# Altium project BASE.PrjPcb
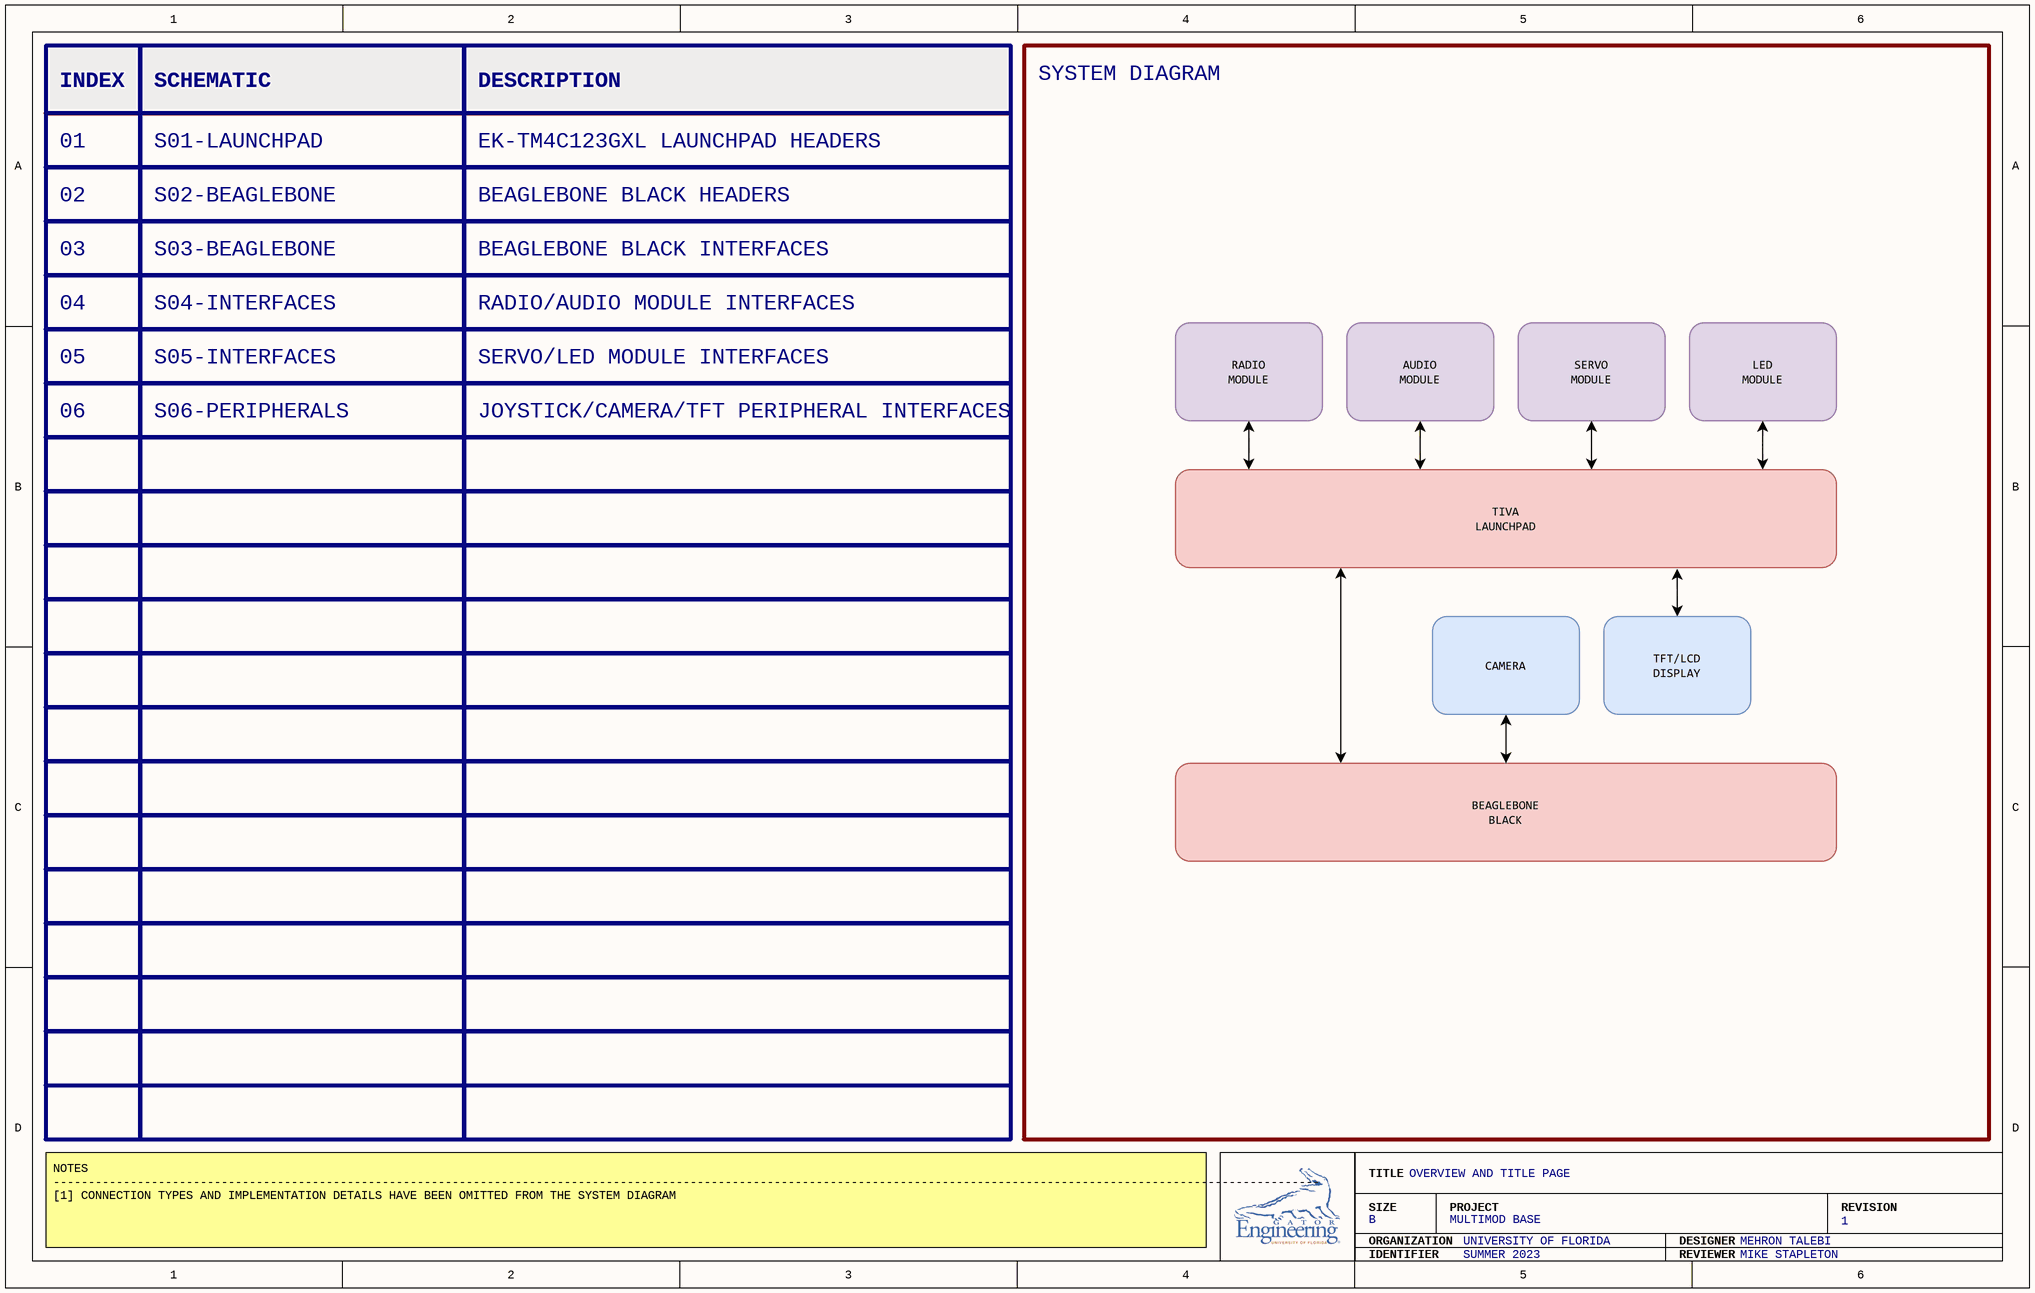
[diagram p0: S00-OVERVIEW.SchDoc]
7 sheets, 35 parts. Net scope: flat (ports and power ports of the same name join across sheets).
Board file: P01-BASE.PcbDoc
Sheets:
  S00-OVERVIEW.SchDoc
  S01-LAUNCHPAD.SchDoc
  S02-BEAGLEBONE.SchDoc
  S03-BEAGLEBONE.SchDoc
  S04-INTERFACES.SchDoc
  S05-INTERFACES.SchDoc
  S06-PERIPHERALS.SchDoc

## Sheet S00-OVERVIEW.SchDoc
size B; SheetNumber: 1; SheetTotal: 7; BLOCK-TITLE: OVERVIEW AND TITLE PAGE; BLOCK-SIZE: B; BLOCK-PROJECT: MULTIMOD BASE; BLOCK-REVISION: 1; BLOCK-ORGANIZATION: UNIVERSITY OF FLORIDA; BLOCK-DESIGNER: MEHRON TALEBI; BLOCK-IDENTIFIER: SUMMER 2023; BLOCK-REVIEWER: MIKE STAPLETON

### Notes on the sheet
- INDEX
- SCHEMATIC
- DESCRIPTION
- SYSTEM DIAGRAM
- 01
- S01-LAUNCHPAD
- EK-TM4C123GXL LAUNCHPAD HEADERS
- 02
- 03
- S02-BEAGLEBONE
- S03-BEAGLEBONE
- BEAGLEBONE BLACK INTERFACES
- BEAGLEBONE BLACK HEADERS
- 04
- S04-INTERFACES
- RADIO/AUDIO MODULE INTERFACES
- 05
- S05-INTERFACES
- SERVO/LED MODULE INTERFACES
- 06
- S06-PERIPHERALS
- JOYSTICK/CAMERA/TFT PERIPHERAL INTERFACES
- NOTES
  -------------------------------------------------------------------------------------------------------------------------------------------------------------------------------------
  [1] CONNECTION TYPES AND IMPLEMENTATION DETAILS HAVE BEEN OMITTED FROM THE SYSTEM DIAGRAM
- TITLE
- SIZE
- ORGANIZATION
- PROJECT
- DESIGNER
- REVISION
- IDENTIFIER
- REVIEWER

## Sheet S01-LAUNCHPAD.SchDoc
size B; SheetNumber: 2; SheetTotal: 7; BLOCK-TITLE: EK-TM4C123GXL LAUNCHPAD HEADERS; BLOCK-SIZE: B; BLOCK-PROJECT: MULTIMOD BASE; BLOCK-REVISION: 1; BLOCK-ORGANIZATION: UNIVERSITY OF FLORIDA; BLOCK-DESIGNER: MEHRON TALEBI; BLOCK-IDENTIFIER: SUMMER 2023; BLOCK-REVIEWER: MIKE STAPLETON
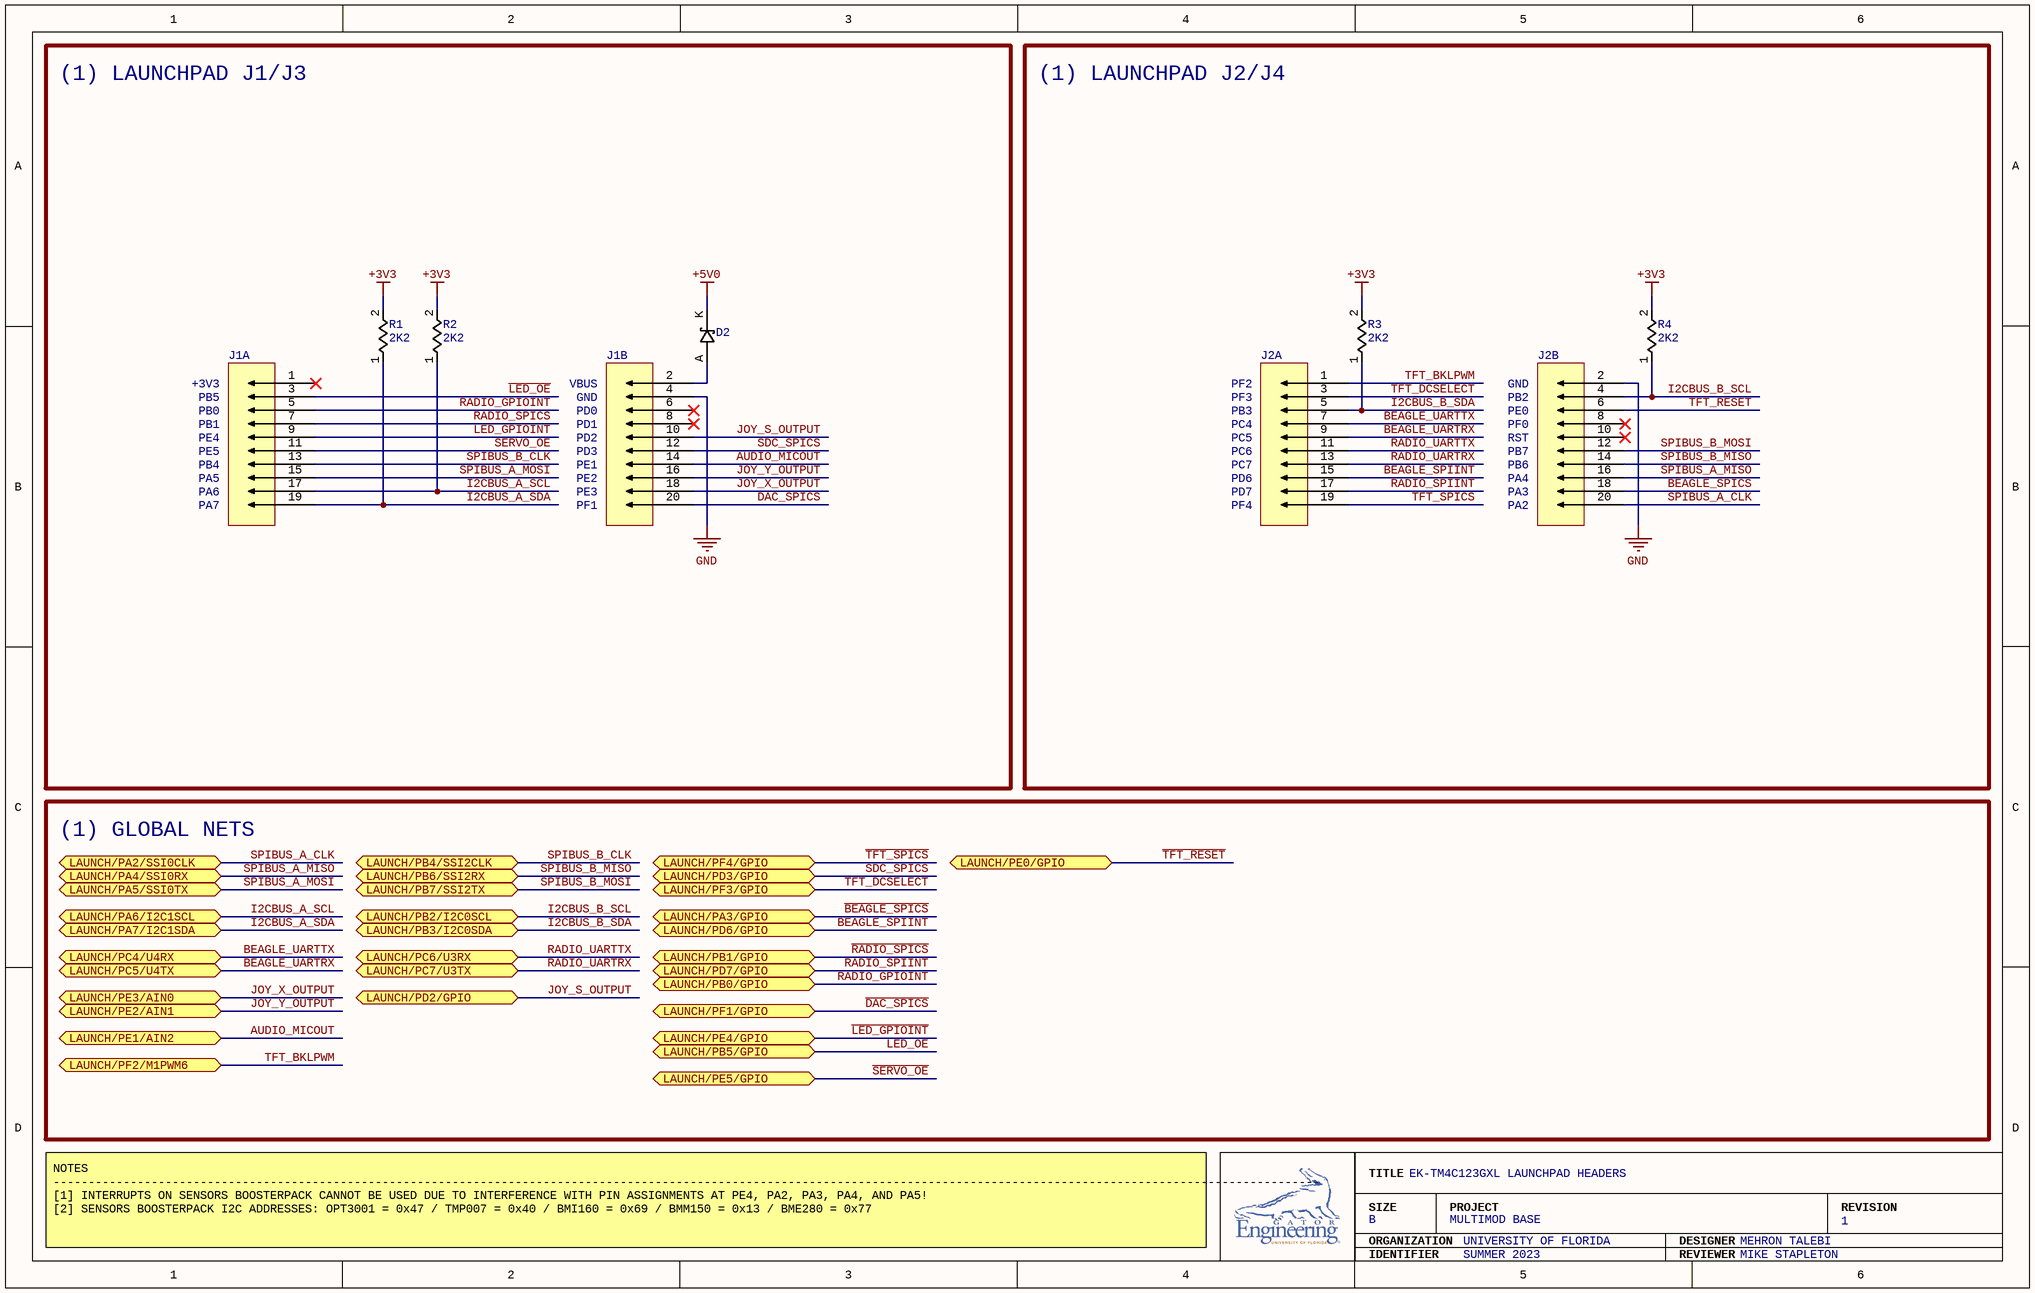
[diagram p1: S01-LAUNCHPAD.SchDoc]

### Parts
D2  RBR5L30BDDTE25  [RBR5L30BDDTE25]  (value not drawn)
J1  95278-101-20LF  [95278-101-20LF]  (value not drawn)  (parts A,B of 2)
J2  95278-101-20LF  [95278-101-20LF]  (value not drawn)  (parts A,B of 2)
R1  2K2  [RC0805FR-072K2L]
R2  2K2  [RC0805FR-072K2L]
R3  2K2  [RC0805FR-072K2L]
R4  2K2  [RC0805FR-072K2L]

### Blocks framed on the sheet
(1) LAUNCHPAD J1/J3: D2 J1 R1 R2
(1) LAUNCHPAD J2/J4: J2 R3 R4

### Ports
LAUNCH/PA2/SSI0CLK (bidir), LAUNCH/PA3/GPIO (bidir), LAUNCH/PA4/SSI0RX (bidir), LAUNCH/PA5/SSI0TX (bidir), LAUNCH/PA6/I2C1SCL (bidir), LAUNCH/PA7/I2C1SDA (bidir), LAUNCH/PB0/GPIO (bidir), LAUNCH/PB1/GPIO (bidir), LAUNCH/PB2/I2C0SCL (bidir), LAUNCH/PB3/I2C0SDA (bidir), LAUNCH/PB4/SSI2CLK (bidir), LAUNCH/PB5/GPIO (bidir), LAUNCH/PB6/SSI2RX (bidir), LAUNCH/PB7/SSI2TX (bidir), LAUNCH/PC4/U4RX (bidir), LAUNCH/PC5/U4TX (bidir), LAUNCH/PC6/U3RX (bidir), LAUNCH/PC7/U3TX (bidir), LAUNCH/PD2/GPIO (bidir), LAUNCH/PD3/GPIO (bidir), LAUNCH/PD6/GPIO (bidir), LAUNCH/PD7/GPIO (bidir), LAUNCH/PE0/GPIO (bidir), LAUNCH/PE1/AIN2 (bidir), LAUNCH/PE2/AIN1 (bidir), LAUNCH/PE3/AIN0 (bidir), LAUNCH/PE4/GPIO (bidir), LAUNCH/PE5/GPIO (bidir), LAUNCH/PF1/GPIO (bidir), LAUNCH/PF2/M1PWM6 (bidir), LAUNCH/PF3/GPIO (bidir), LAUNCH/PF4/GPIO (bidir)

### Nets
+3V3: R1.2 R2.2 R3.2 R4.2
+5V0: D2.K(+)
GND: J1.4 J2.2
~{BEAGLE_SPICS}: J2.18 ; port LAUNCH/PA3/GPIO
~{DAC_SPICS}: J1.20 ; port LAUNCH/PF1/GPIO
~{LED_GPIOINT}: J1.9 ; port LAUNCH/PE4/GPIO
~{LED_OE}: J1.3 ; port LAUNCH/PB5/GPIO
~{RADIO_SPICS}: J1.7 ; port LAUNCH/PB1/GPIO
~{SDC_SPICS}: J1.12 ; port LAUNCH/PD3/GPIO
~{SERVO_OE}: J1.11 ; port LAUNCH/PE5/GPIO
~{TFT_RESET}: J2.6 ; port LAUNCH/PE0/GPIO
~{TFT_SPICS}: J2.19 ; port LAUNCH/PF4/GPIO
AUDIO_MICOUT: J1.14 ; port LAUNCH/PE1/AIN2
BEAGLE_SPIINT: J2.15 ; port LAUNCH/PD6/GPIO
BEAGLE_UARTRX: J2.9 ; port LAUNCH/PC5/U4TX
BEAGLE_UARTTX: J2.7 ; port LAUNCH/PC4/U4RX
I2CBUS_A_SCL: J1.17 R2.1 ; port LAUNCH/PA6/I2C1SCL
I2CBUS_A_SDA: J1.19 R1.1 ; port LAUNCH/PA7/I2C1SDA
I2CBUS_B_SCL: J2.4 R4.1 ; port LAUNCH/PB2/I2C0SCL
I2CBUS_B_SDA: J2.5 R3.1 ; port LAUNCH/PB3/I2C0SDA
JOY_S_OUTPUT: J1.10 ; port LAUNCH/PD2/GPIO
JOY_X_OUTPUT: J1.18 ; port LAUNCH/PE3/AIN0
JOY_Y_OUTPUT: J1.16 ; port LAUNCH/PE2/AIN1
RADIO_GPIOINT: J1.5 ; port LAUNCH/PB0/GPIO
RADIO_SPIINT: J2.17 ; port LAUNCH/PD7/GPIO
RADIO_UARTRX: J2.13 ; port LAUNCH/PC7/U3TX
RADIO_UARTTX: J2.11 ; port LAUNCH/PC6/U3RX
SPIBUS_A_CLK: J2.20 ; port LAUNCH/PA2/SSI0CLK
SPIBUS_A_MISO: J2.16 ; port LAUNCH/PA4/SSI0RX
SPIBUS_A_MOSI: J1.15 ; port LAUNCH/PA5/SSI0TX
SPIBUS_B_CLK: J1.13 ; port LAUNCH/PB4/SSI2CLK
SPIBUS_B_MISO: J2.14 ; port LAUNCH/PB6/SSI2RX
SPIBUS_B_MOSI: J2.12 ; port LAUNCH/PB7/SSI2TX
TFT_BKLPWM: J2.1 ; port LAUNCH/PF2/M1PWM6
TFT_DCSELECT: J2.3 ; port LAUNCH/PF3/GPIO
NetD2_A: D2.A(-) J1.2

Not connected (* = marked no-connect by the designer): J1 1* 6* 8*; J2 8* 10*

### Notes on the sheet
- +3V3
- PB0
- PB1
- PE4
- PB5
- VBUS
- GND
- PD0
- PD1
- PD2
- PF2
- PF3
- PB3
- PC4
- PC5
- PB2
- PE0
- PF0
- RST
- PE5
- PB4
- PA5
- PA6
- PA7
- PD3
- PE1
- PE2
- PE3
- PF1
- PC6
- PC7
- PD6
- PD7
- PF4
- PB7
- PB6
- PA4
- PA3
- PA2
- (1) GLOBAL NETS
- NOTES
  -------------------------------------------------------------------------------------------------------------------------------------------------------------------------------------
  [1] INTERRUPTS ON SENSORS BOOSTERPACK CANNOT BE USED DUE TO INTERFERENCE WITH PIN ASSIGNMENTS AT PE4, PA2, PA3, PA4, AND PA5!
  [2] SENSORS BOOSTERPACK I2C ADDRESSES: OPT3001 = 0x47 / TMP007 = 0x40 / BMI160 = 0x69 / BMM150 = 0x13 / BME280 = 0x77
- TITLE
- SIZE
- ORGANIZATION
- PROJECT
- DESIGNER
- REVISION
- IDENTIFIER
- REVIEWER

### Library data of the parts
D2 = RBR5L30BDDTE25: DIODE SCHOTTKY 30V 5A PMDS; Voltage - Forward (Vf) (Max) @ If: 490 mV @ 5 A; Speed: Fast Recovery =< 500ns, > 200mA (Io); Current - Reverse Leakage @ Vr: 150 µA @ 30 V; Diode Type: Schottky; Voltage - DC Reverse (Vr) (Max): 30 V; Current - Average Rectified (Io): 5A; Mounting Type: Surface Mount; Package / Case: DO-214AC, SMA; Operating Temperature - Junction: -55°C ~ 150°C; Supplier 1: Digi-Key; Supplier Part Number 1: 846-RBR5L30BDDTE25CT-ND
J1 J2 = 95278-101-20LF: CONN HEADER SMD 20POS 2.54MM; Connector Type: Header, Breakaway; Pitch - Mating: 0.100" (2.54mm); Number of Positions: 20; Number of Positions Loaded: All; Style: Board to Board; Shrouding: Unshrouded; Contact Length - Mating: 0.232" (5.90mm); Material Flammability Rating: UL94 V-0; Current Rating (Amps): 3A per Contact; Contact Type: Male Pin; Number of Rows: 2; Row Spacing - Mating: 0.100" (2.54mm); Mounting Type: Surface Mount; Termination: Solder; Fastening Type: Push-Pull; Insulation Height: 0.100" (2.54mm); Contact Shape: Square; Contact Finish - Mating: Gold, GXT™; Contact Finish Thickness - Mating: 30.0µin (0.76µm); Contact Finish - Post: Tin; Contact Material: Phosphor Bronze; Insulation Material: Thermoplastic; Operating Temperature: -65°C ~ 125°C; Insulation Color: Black; Contact Finish Thickness - Post: 78.7µin (2.00µm); Supplier 1: Arrow Electronics; Supplier Part Number 1: 95278-101-20LF
R1-R4 = RC0805FR-072K2L: RES 2.2K OHM 1% 1/8W 0805; Resistance: 2.2 kOhms; Power (Watts): 0.125W, 1/8W; Temperature Coefficient: ±100ppm/°C; Tolerance: ±1%; Composition: Thick Film; Features: Moisture Resistant; Operating Temperature: -55°C ~ 155°C; Package / Case: 0805 (2012 Metric); Supplier Device Package: 0805; Size / Dimension: 0.079" L x 0.049" W (2.00mm x 1.25mm); Height - Seated (Max): 0.024" (0.60mm); Number of Terminations: 2; Supplier 1: Digi-Key; Supplier Part Number 1: 311-2.20KCRDKR-ND

## Sheet S02-BEAGLEBONE.SchDoc
size B; SheetNumber: 3; SheetTotal: 7; BLOCK-TITLE: BEAGLEBONE BLACK HEADERS; BLOCK-SIZE: B; BLOCK-PROJECT: MULTIMOD BASE; BLOCK-REVISION: 1; BLOCK-ORGANIZATION: UNIVERSITY OF FLORIDA; BLOCK-DESIGNER: MEHRON TALEBI; BLOCK-IDENTIFIER: SUMMER 2023; BLOCK-REVIEWER: MIKE STAPLETON
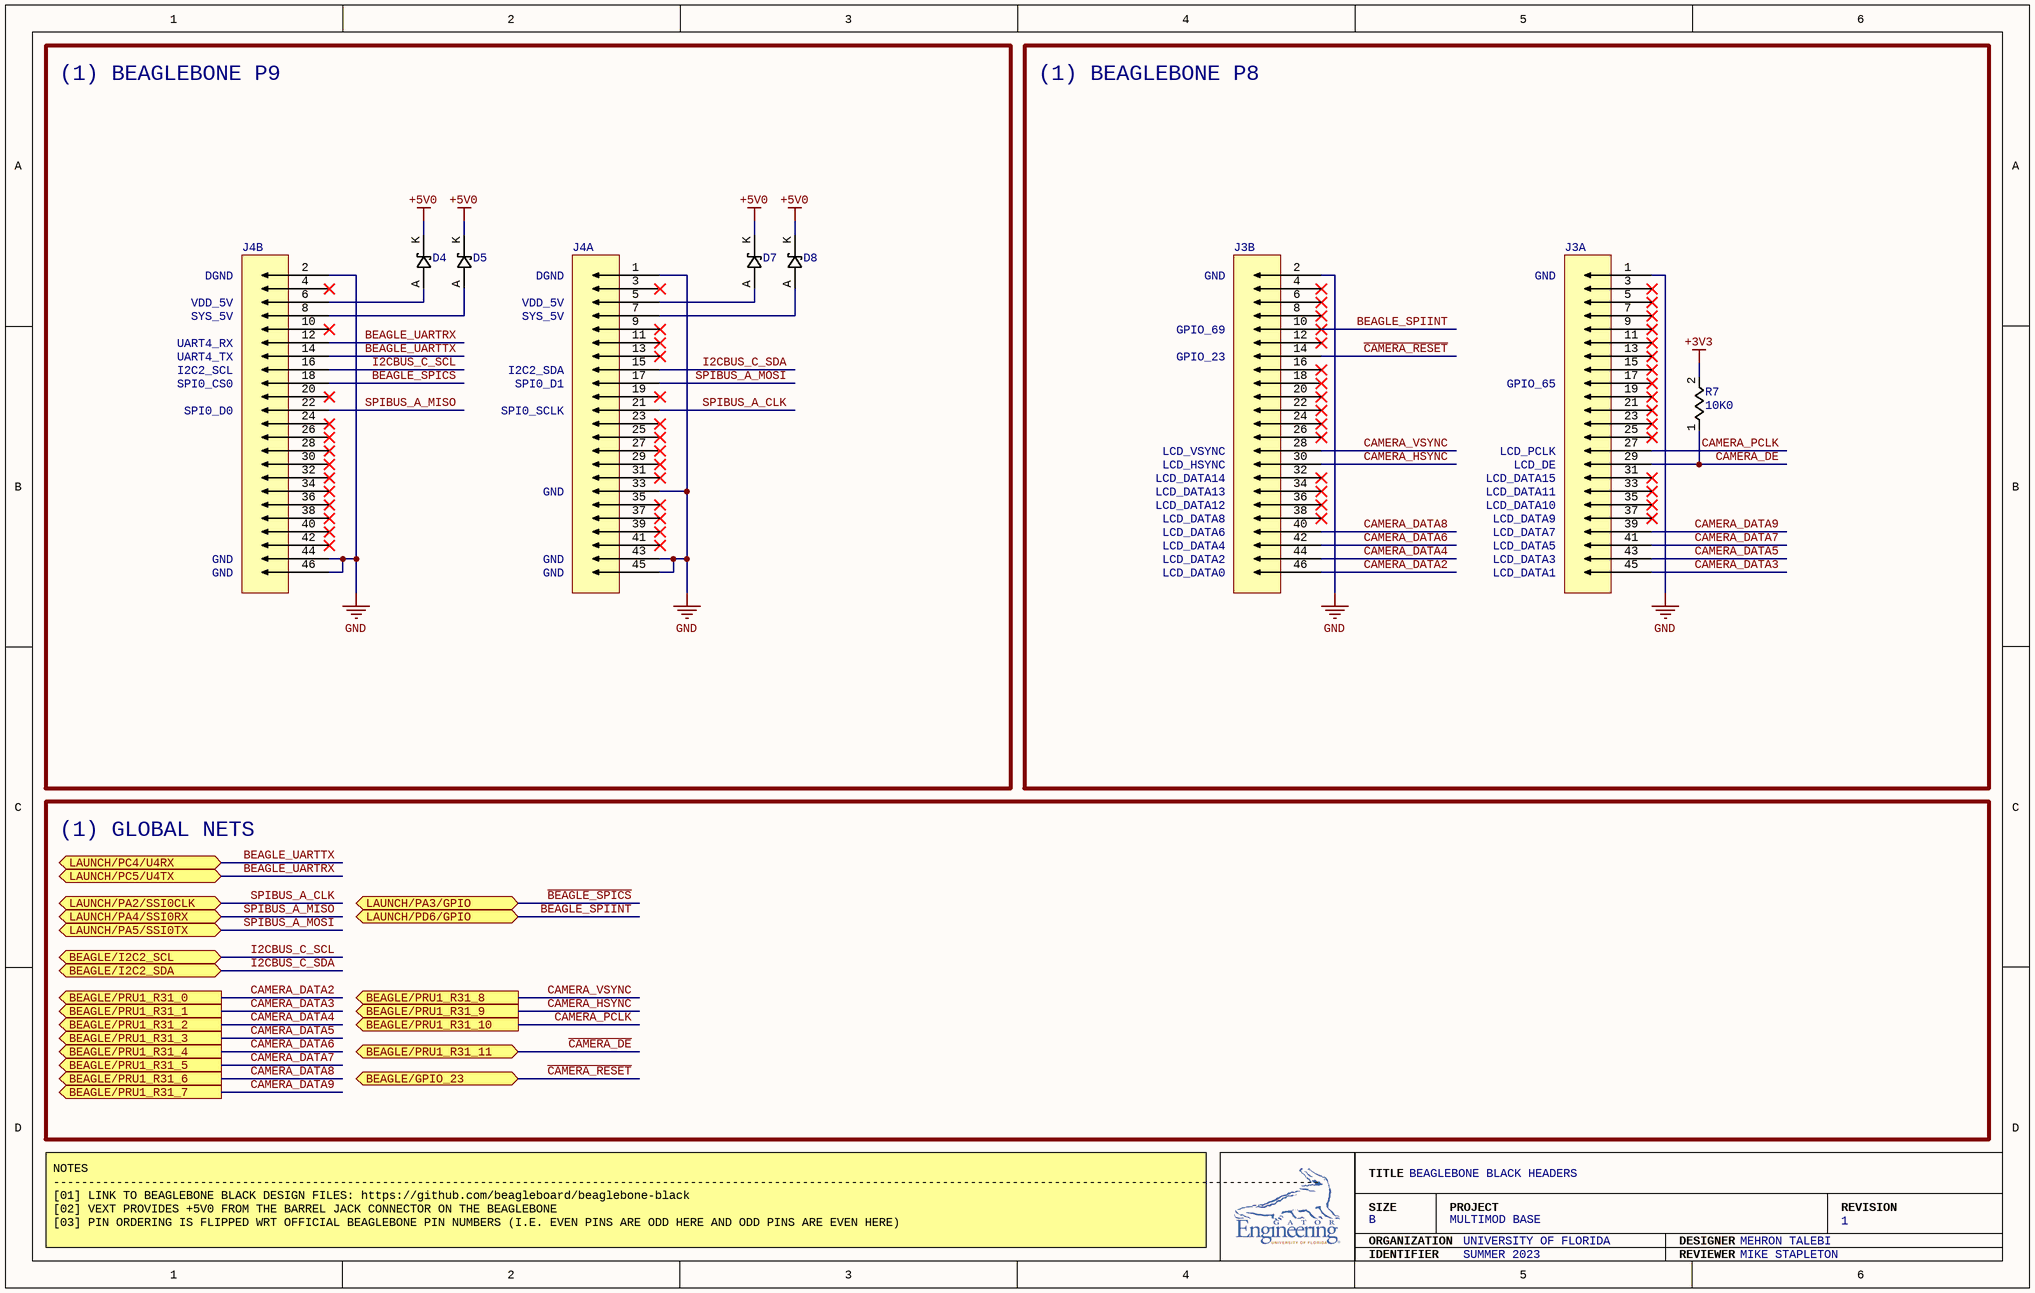
[diagram p2: S02-BEAGLEBONE.SchDoc]

### Parts
D4  RBR5L30BDDTE25  [RBR5L30BDDTE25]  (value not drawn)
D5  RBR5L30BDDTE25  [RBR5L30BDDTE25]  (value not drawn)
D7  RBR5L30BDDTE25  [RBR5L30BDDTE25]  (value not drawn)
D8  RBR5L30BDDTE25  [RBR5L30BDDTE25]  (value not drawn)
J3  95278-101-46LF  [95278-101-46LF]  (value not drawn)  (parts A,B of 2)
J4  95278-101-46LF  [95278-101-46LF]  (value not drawn)  (parts A,B of 2)
R7  10K0  [RC0805FR-0710KL]

### Blocks framed on the sheet
(1) BEAGLEBONE P9: D4 D5 D7 D8 J4
(1) BEAGLEBONE P8: J3 R7

### Ports
BEAGLE/GPIO_23 (bidir), BEAGLE/I2C2_SCL (bidir), BEAGLE/I2C2_SDA (bidir), BEAGLE/PRU1_R31_0 (out), BEAGLE/PRU1_R31_1 (out), BEAGLE/PRU1_R31_2 (out), BEAGLE/PRU1_R31_3 (out), BEAGLE/PRU1_R31_4 (out), BEAGLE/PRU1_R31_5 (out), BEAGLE/PRU1_R31_6 (out), BEAGLE/PRU1_R31_7 (out), BEAGLE/PRU1_R31_8 (out), BEAGLE/PRU1_R31_9 (out), BEAGLE/PRU1_R31_10 (out), BEAGLE/PRU1_R31_11 (bidir), LAUNCH/PA2/SSI0CLK (bidir), LAUNCH/PA3/GPIO (bidir), LAUNCH/PA4/SSI0RX (bidir), LAUNCH/PA5/SSI0TX (bidir), LAUNCH/PC4/U4RX (bidir), LAUNCH/PC5/U4TX (bidir), LAUNCH/PD6/GPIO (bidir)

### Nets
+3V3: R7.2
+5V0: D4.K(+) D5.K(+) D7.K(+) D8.K(+)
GND: J3.1 J3.2 J4.1 J4.2 J4.33 J4.43 J4.44 J4.45 J4.46
~{BEAGLE_SPICS}: J4.18 ; port LAUNCH/PA3/GPIO
~{CAMERA_DE}: J3.29 R7.1 ; port BEAGLE/PRU1_R31_11
~{CAMERA_RESET}: J3.14 ; port BEAGLE/GPIO_23
BEAGLE_SPIINT: J3.10 ; port LAUNCH/PD6/GPIO
BEAGLE_UARTRX: J4.12 ; port LAUNCH/PC5/U4TX
BEAGLE_UARTTX: J4.14 ; port LAUNCH/PC4/U4RX
CAMERA_DATA2: J3.46 ; port BEAGLE/PRU1_R31_0
CAMERA_DATA3: J3.45 ; port BEAGLE/PRU1_R31_1
CAMERA_DATA4: J3.44 ; port BEAGLE/PRU1_R31_2
CAMERA_DATA5: J3.43 ; port BEAGLE/PRU1_R31_3
CAMERA_DATA6: J3.42 ; port BEAGLE/PRU1_R31_4
CAMERA_DATA7: J3.41 ; port BEAGLE/PRU1_R31_5
CAMERA_DATA8: J3.40 ; port BEAGLE/PRU1_R31_6
CAMERA_DATA9: J3.39 ; port BEAGLE/PRU1_R31_7
CAMERA_HSYNC: J3.30 ; port BEAGLE/PRU1_R31_9
CAMERA_PCLK: J3.27 ; port BEAGLE/PRU1_R31_10
CAMERA_VSYNC: J3.28 ; port BEAGLE/PRU1_R31_8
I2CBUS_C_SCL: J4.16 ; port BEAGLE/I2C2_SCL
I2CBUS_C_SDA: J4.15 ; port BEAGLE/I2C2_SDA
SPIBUS_A_CLK: J4.21 ; port LAUNCH/PA2/SSI0CLK
SPIBUS_A_MISO: J4.22 ; port LAUNCH/PA4/SSI0RX
SPIBUS_A_MOSI: J4.17 ; port LAUNCH/PA5/SSI0TX
NetD4_A: D4.A(-) J4.6
NetD5_A: D5.A(-) J4.8
NetD7_A: D7.A(-) J4.5
NetD8_A: D8.A(-) J4.7

Not connected (* = marked no-connect by the designer): J3 3* 4* 5* 6* 7* 8* 9* 11* 12* 13* 15* 16* 17* 18* 19* 20* 21* 22* 23* 24* 25* 26* 31* 32* 33* 34* 35* 36* 37* 38*; J4 3* 4* 9* 10* 11* 13* 19* 20* 23* 24* 25* 26* 27* 28* 29* 30* 31* 32* 34* 35* 36* 37* 38* 39* 40* 41* 42*

### Notes on the sheet
- DGND
- VDD_5V
- GND
- SYS_5V
- I2C2_SCL
- UART4_RX
- UART4_TX
- I2C2_SDA
- GPIO_23
- GPIO_69
- SPI0_CS0
- SPI0_D0
- SPI0_D1
- SPI0_SCLK
- GPIO_65
- LCD_VSYNC
- LCD_HSYNC
- LCD_DATA13
- LCD_DATA12
- LCD_DATA14
- LCD_PCLK
- LCD_DE
- LCD_DATA11
- LCD_DATA10
- LCD_DATA15
- LCD_DATA8
- LCD_DATA6
- LCD_DATA4
- LCD_DATA2
- LCD_DATA0
- LCD_DATA9
- LCD_DATA7
- LCD_DATA5
- LCD_DATA3
- LCD_DATA1
- (1) GLOBAL NETS
- NOTES
  -------------------------------------------------------------------------------------------------------------------------------------------------------------------------------------
  [01] LINK TO BEAGLEBONE BLACK DESIGN FILES: https://github.com/beagleboard/beaglebone-black
  [02] VEXT PROVIDES +5V0 FROM THE BARREL JACK CONNECTOR ON THE BEAGLEBONE
  [03] PIN ORDERING IS FLIPPED WRT OFFICIAL BEAGLEBONE PIN NUMBERS (I.E. EVEN PINS ARE ODD HERE AND ODD PINS ARE EVEN HERE)
- TITLE
- SIZE
- ORGANIZATION
- PROJECT
- DESIGNER
- REVISION
- IDENTIFIER
- REVIEWER

### Library data of the parts
D4 D5 D7 D8 = RBR5L30BDDTE25: as D2 on sheet S01-LAUNCHPAD; Diode Type: Schottky; Voltage - DC Reverse (Vr) (Max): 30 V; Current - Average Rectified (Io): 5A; Mounting Type: Surface Mount; Package / Case: DO-214AC, SMA; Operating Temperature - Junction: -55°C ~ 150°C; Supplier 1: Digi-Key; Supplier Part Number 1: 846-RBR5L30BDDTE25CT-ND
J3 J4 = 95278-101-46LF: CONN HEADER SMD 46POS 2.54MM; Connector Type: Header, Breakaway; Pitch - Mating: 0.100" (2.54mm); Number of Positions: 46; Number of Positions Loaded: All; Style: Board to Board; Shrouding: Unshrouded; Contact Length - Mating: 0.232" (5.90mm); Material Flammability Rating: UL94 V-0; Current Rating (Amps): 3A per Contact; Contact Type: Male Pin; Number of Rows: 2; Row Spacing - Mating: 0.100" (2.54mm); Mounting Type: Surface Mount; Termination: Solder; Fastening Type: Push-Pull; Insulation Height: 0.100" (2.54mm); Contact Shape: Square; Contact Finish - Mating: Gold, GXT™; Contact Finish Thickness - Mating: 30.0µin (0.76µm); Contact Finish - Post: Tin; Contact Material: Phosphor Bronze; Insulation Material: Thermoplastic; Operating Temperature: -65°C ~ 125°C; Insulation Color: Black; Contact Finish Thickness - Post: 78.7µin (2.00µm); Supplier 1: Newark; Supplier Part Number 1: 17M5553
R7 = RC0805FR-0710KL: RES 10K OHM 1% 1/8W 0805; Resistance: 10 kOhms; Power (Watts): 0.125W, 1/8W; Temperature Coefficient: ±100ppm/°C; Tolerance: ±1%; Composition: Thick Film; Features: Moisture Resistant; Operating Temperature: -55°C ~ 155°C; Package / Case: 0805 (2012 Metric); Supplier Device Package: 0805; Size / Dimension: 0.079" L x 0.049" W (2.00mm x 1.25mm); Height - Seated (Max): 0.024" (0.60mm); Number of Terminations: 2; Supplier 1: Future Electronics; Supplier Part Number 1: 3310877

## Sheet S03-BEAGLEBONE.SchDoc
size B; SheetNumber: 4; SheetTotal: 7; BLOCK-TITLE: BEAGLEBONE BLACK INTERFACES; BLOCK-SIZE: B; BLOCK-PROJECT: MULTIMOD BASE; BLOCK-REVISION: 1; BLOCK-ORGANIZATION: UNIVERSITY OF FLORIDA; BLOCK-DESIGNER: MEHRON TALEBI; BLOCK-IDENTIFIER: SUMMER 2023; BLOCK-REVIEWER: MIKE STAPLETON
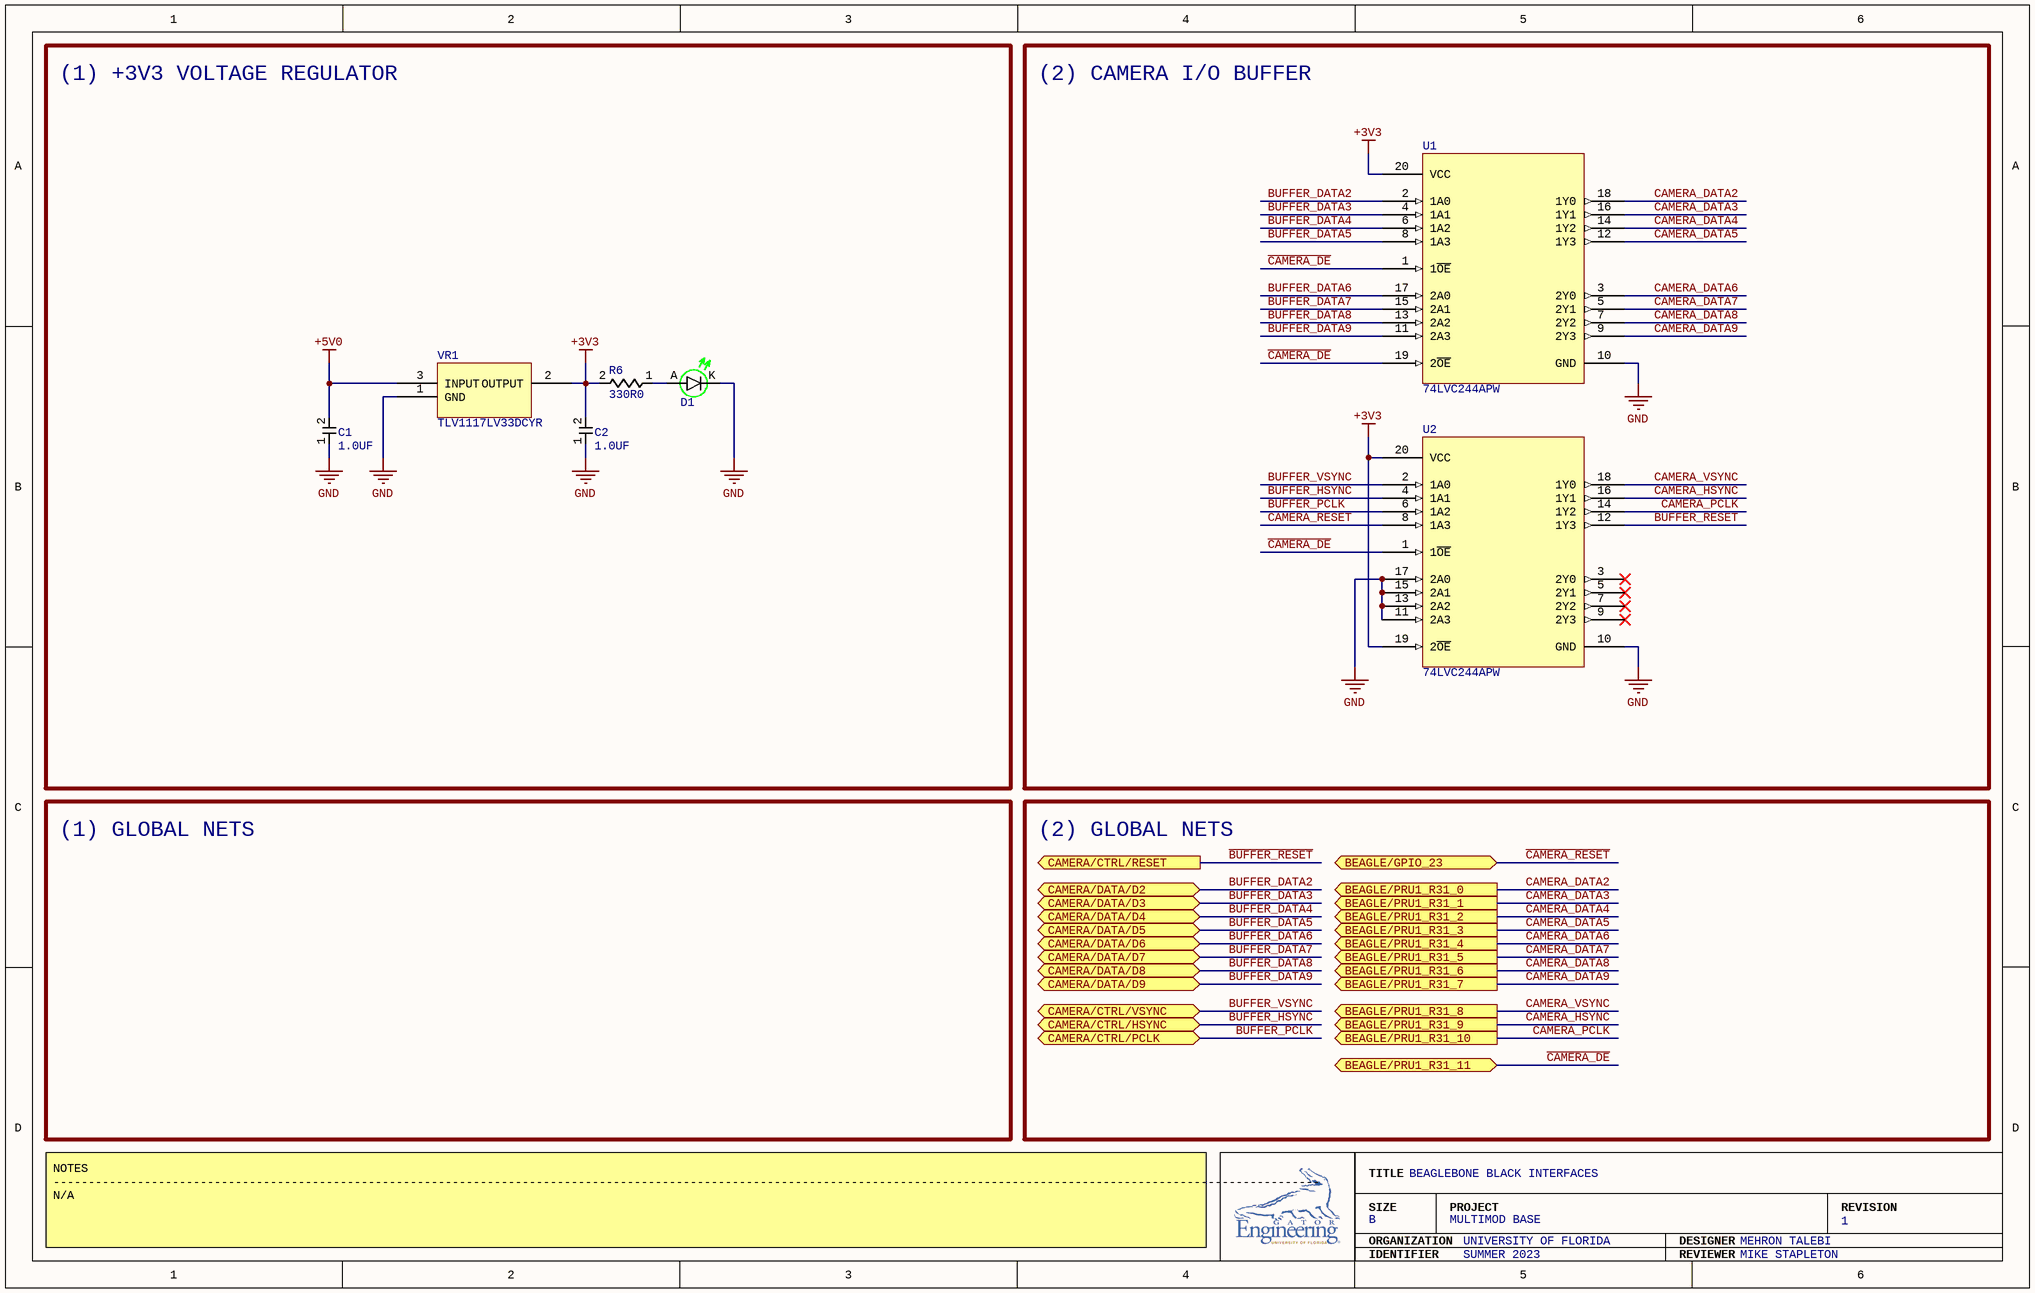
[diagram p3: S03-BEAGLEBONE.SchDoc]

### Parts
C1  1.0UF  [CL21B105KAFNFNE]
C2  1.0UF  [CL21B105KAFNFNE]
D1  LTST-C171GKT  [LTST-C171GKT]  (value not drawn)
R6  330R0  [RC0805FR-7W330RL]
U1  74LVC244APW  [74LVC244APW]
U2  74LVC244APW  [74LVC244APW]
VR1  TLV1117LV33DCYR  [TLV1117LV33DCYR]

### Blocks framed on the sheet
(1) +3V3 VOLTAGE REGULATOR: C1 C2 D1 R6 VR1
(2) CAMERA I/O BUFFER: U1 U2

### Ports
BEAGLE/GPIO_23 (bidir), BEAGLE/PRU1_R31_0 (out), BEAGLE/PRU1_R31_1 (out), BEAGLE/PRU1_R31_2 (out), BEAGLE/PRU1_R31_3 (out), BEAGLE/PRU1_R31_4 (out), BEAGLE/PRU1_R31_5 (out), BEAGLE/PRU1_R31_6 (out), BEAGLE/PRU1_R31_7 (out), BEAGLE/PRU1_R31_8 (out), BEAGLE/PRU1_R31_9 (out), BEAGLE/PRU1_R31_10 (out), BEAGLE/PRU1_R31_11 (bidir), CAMERA/CTRL/HSYNC (bidir), CAMERA/CTRL/PCLK (bidir), CAMERA/CTRL/RESET (out), CAMERA/CTRL/VSYNC (bidir), CAMERA/DATA/D2 (bidir), CAMERA/DATA/D3 (bidir), CAMERA/DATA/D4 (bidir), CAMERA/DATA/D5 (bidir), CAMERA/DATA/D6 (bidir), CAMERA/DATA/D7 (bidir), CAMERA/DATA/D8 (bidir), CAMERA/DATA/D9 (bidir)

### Nets
+3V3: C2.2 R6.2 U1.20(VCC) U2.19(2~{OE}) U2.20(VCC) VR1.2(OUTPUT)
+5V0: C1.2 VR1.3(INPUT)
GND: C1.1 C2.1 D1.K U1.10(GND) U2.10(GND) U2.11(2A3) U2.13(2A2) U2.15(2A1) U2.17(2A0) VR1.1(GND)
~{BUFFER_RESET}: U2.12(1Y3) ; port CAMERA/CTRL/RESET
~{CAMERA_DE}: U1.1(1~{OE}) U1.19(2~{OE}) U2.1(1~{OE}) ; port BEAGLE/PRU1_R31_11
~{CAMERA_RESET}: U2.8(1A3) ; port BEAGLE/GPIO_23
BUFFER_DATA2: U1.2(1A0) ; port CAMERA/DATA/D2
BUFFER_DATA3: U1.4(1A1) ; port CAMERA/DATA/D3
BUFFER_DATA4: U1.6(1A2) ; port CAMERA/DATA/D4
BUFFER_DATA5: U1.8(1A3) ; port CAMERA/DATA/D5
BUFFER_DATA6: U1.17(2A0) ; port CAMERA/DATA/D6
BUFFER_DATA7: U1.15(2A1) ; port CAMERA/DATA/D7
BUFFER_DATA8: U1.13(2A2) ; port CAMERA/DATA/D8
BUFFER_DATA9: U1.11(2A3) ; port CAMERA/DATA/D9
BUFFER_HSYNC: U2.4(1A1) ; port CAMERA/CTRL/HSYNC
BUFFER_PCLK: U2.6(1A2) ; port CAMERA/CTRL/PCLK
BUFFER_VSYNC: U2.2(1A0) ; port CAMERA/CTRL/VSYNC
CAMERA_DATA2: U1.18(1Y0) ; port BEAGLE/PRU1_R31_0
CAMERA_DATA3: U1.16(1Y1) ; port BEAGLE/PRU1_R31_1
CAMERA_DATA4: U1.14(1Y2) ; port BEAGLE/PRU1_R31_2
CAMERA_DATA5: U1.12(1Y3) ; port BEAGLE/PRU1_R31_3
CAMERA_DATA6: U1.3(2Y0) ; port BEAGLE/PRU1_R31_4
CAMERA_DATA7: U1.5(2Y1) ; port BEAGLE/PRU1_R31_5
CAMERA_DATA8: U1.7(2Y2) ; port BEAGLE/PRU1_R31_6
CAMERA_DATA9: U1.9(2Y3) ; port BEAGLE/PRU1_R31_7
CAMERA_HSYNC: U2.16(1Y1) ; port BEAGLE/PRU1_R31_9
CAMERA_PCLK: U2.14(1Y2) ; port BEAGLE/PRU1_R31_10
CAMERA_VSYNC: U2.18(1Y0) ; port BEAGLE/PRU1_R31_8
NetD1_A: D1.A R6.1

Not connected (* = marked no-connect by the designer): U2 3(2Y0)* 5(2Y1)* 7(2Y2)* 9(2Y3)*

### Notes on the sheet
- (1) GLOBAL NETS
- (2) GLOBAL NETS
- NOTES
  -------------------------------------------------------------------------------------------------------------------------------------------------------------------------------------
  N/A
- TITLE
- SIZE
- ORGANIZATION
- PROJECT
- DESIGNER
- REVISION
- IDENTIFIER
- REVIEWER

### Library data of the parts
C1 C2 = CL21B105KAFNFNE: CAP CER 1UF 25V X7R 0805; Capacitance: 1 µF; Tolerance: ±10%; Voltage - Rated: 25V; Temperature Coefficient: X7R; Operating Temperature: -55°C ~ 125°C; Applications: General Purpose; Mounting Type: Surface Mount, MLCC; Package / Case: 0805 (2012 Metric); Size / Dimension: 0.079" L x 0.049" W (2.00mm x 1.25mm); Thickness (Max): 0.053" (1.35mm); Supplier 1: Arrow Electronics; Supplier Part Number 1: CL21B105KAFNFNE
D1 = LTST-C171GKT: LED GREEN CLEAR CHIP SMD; Configuration: Standard; Lens Color: Colorless; Millicandela Rating: 12mcd; Lens Style: Rectangle with Flat Top; Lens Size: 1.40mm x 1.25mm; Voltage - Forward (Vf) (Typ): 2.1V; Current - Test: 20mA; Viewing Angle: 130°; Wavelength - Dominant: 569nm; Wavelength - Peak: 565nm; Color: Green; Lens Transparency: Clear; Mounting Type: Surface Mount; Package / Case: 0805 (2012 Metric); Supplier Device Package: Chip LED; Size / Dimension: 2.00mm L x 1.25mm W; Height (Max): 0.90mm; Supplier 1: Digi-Key; Supplier Part Number 1: 160-1423-1-ND
R6 = RC0805FR-7W330RL: RES 330 OHM 1% 1/4W 0805; Resistance: 330 Ohms; Power (Watts): 0.25W, 1/4W; Temperature Coefficient: ±100ppm/°C; Tolerance: ±1%; Composition: Thick Film; Features: Moisture Resistant; Operating Temperature: -55°C ~ 155°C; Supplier Device Package: 0805; Size / Dimension: 0.079" L x 0.049" W (2.00mm x 1.25mm); Height - Seated (Max): 0.024" (0.60mm); Number of Terminations: 2; Supplier 1: Mouser; Supplier Part Number 1: 603-RC0805FR-7W330RL
U1 U2 = 74LVC244APW: IC BUF NON-INVERT 3.6V 20TSSOP; Logic Type: Buffer, Non-Inverting; Number of Elements: 2; Number of Bits per Element: 4; Output Type: 3-State; Current - Output High, Low: 24mA, 24mA; Voltage - Supply: 1.2V ~ 3.6V; Operating Temperature: -40°C ~ 125°C (TA); Mounting Type: Surface Mount; Package / Case: 20-TSSOP (0.173", 4.40mm Width); Supplier Device Package: 20-TSSOP; Supplier 1: Digi-Key; Supplier Part Number 1: 1727-2875-1-ND
VR1 = TLV1117LV33DCYR: IC REG LINEAR 3.3V 1A SOT223-4; Output Configuration: Positive; Output Type: Fixed; Number of Regulators: 1; Voltage - Input (Max): 5.5V; Voltage Dropout (Max): 1.3V @ 800mA; Current - Quiescent (Iq): 100 µA; PSRR: 75dB (120Hz); Protection Features: Over Current, Over Temperature; Voltage - Output (Min/Fixed): 3.3V; Current - Output: 1A; Operating Temperature: -40°C ~ 125°C; Mounting Type: Surface Mount; Package / Case: TO-261-4, TO-261AA; ComponentLink1Description: Datasheet; ComponentLink1URL: https://www.ti.com/lit/ds/symlink/tlv1117lv.pdf; Supplier 1: Digi-Key; Supplier Part Number 1: 296-28778-1-ND

## Sheet S04-INTERFACES.SchDoc
size B; SheetNumber: 5; SheetTotal: 7; BLOCK-TITLE: RADIO/AUDIO MODULE INTERFACES; BLOCK-SIZE: B; BLOCK-PROJECT: MULTIMOD BASE; BLOCK-REVISION: 1; BLOCK-ORGANIZATION: UNIVERSITY OF FLORIDA; BLOCK-DESIGNER: MEHRON TALEBI; BLOCK-IDENTIFIER: SUMMER 2023; BLOCK-REVIEWER: MIKE STAPLETON
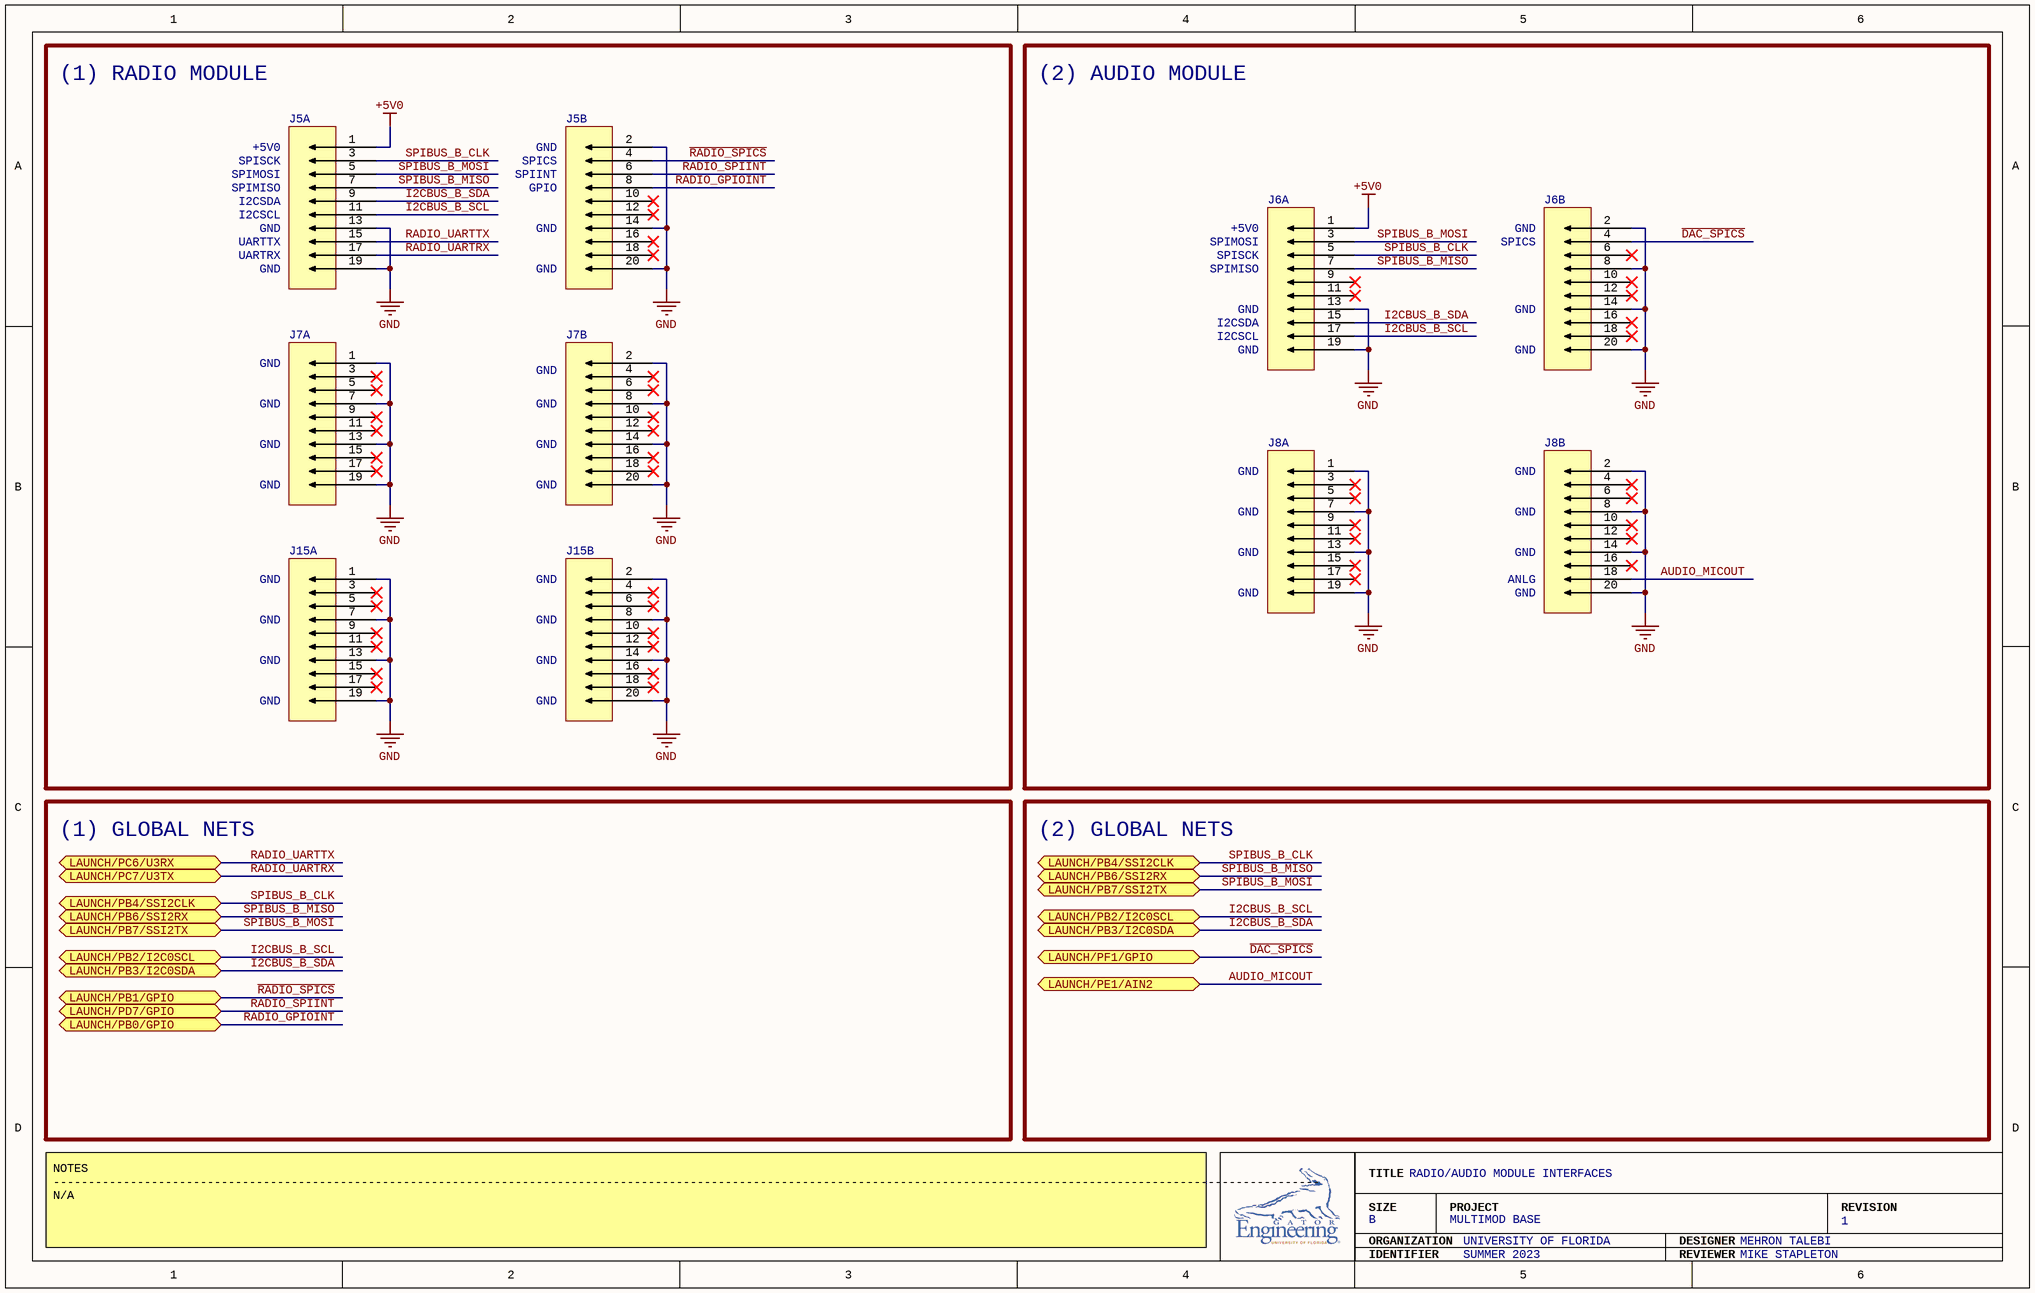
[diagram p4: S04-INTERFACES.SchDoc]

### Parts
J5  95278-101-20LF  [95278-101-20LF]  (value not drawn)  (parts A,B of 2)
J6  95278-101-20LF  [95278-101-20LF]  (value not drawn)  (parts A,B of 2)
J7  95278-101-20LF  [95278-101-20LF]  (value not drawn)  (parts A,B of 2)
J8  95278-101-20LF  [95278-101-20LF]  (value not drawn)  (parts A,B of 2)
J15  95278-101-20LF  [95278-101-20LF]  (value not drawn)  (parts A,B of 2)

### Blocks framed on the sheet
(1) RADIO MODULE: J5 J7 J15
(2) AUDIO MODULE: J6 J8

### Ports
LAUNCH/PB0/GPIO (bidir), LAUNCH/PB1/GPIO (bidir), LAUNCH/PB2/I2C0SCL (bidir), LAUNCH/PB3/I2C0SDA (bidir), LAUNCH/PB4/SSI2CLK (bidir), LAUNCH/PB6/SSI2RX (bidir), LAUNCH/PB7/SSI2TX (bidir), LAUNCH/PC6/U3RX (bidir), LAUNCH/PC7/U3TX (bidir), LAUNCH/PD7/GPIO (bidir), LAUNCH/PE1/AIN2 (bidir), LAUNCH/PF1/GPIO (bidir)

### Nets
+5V0: J5.1 J6.1
GND: J5.2 J5.13 J5.14 J5.19 J5.20 J6.2 J6.8 J6.13 J6.14 J6.19 J6.20 J7.1 J7.2 J7.7 J7.8 J7.13 J7.14 J7.19 J7.20 J8.1 J8.2 J8.7 J8.8 J8.13 J8.14 J8.19 J8.20 J15.1 J15.2 J15.7 J15.8 J15.13 J15.14 J15.19 J15.20
~{DAC_SPICS}: J6.4 ; port LAUNCH/PF1/GPIO
~{RADIO_SPICS}: J5.4 ; port LAUNCH/PB1/GPIO
AUDIO_MICOUT: J8.18 ; port LAUNCH/PE1/AIN2
I2CBUS_B_SCL: J5.11 J6.17 ; port LAUNCH/PB2/I2C0SCL
I2CBUS_B_SDA: J5.9 J6.15 ; port LAUNCH/PB3/I2C0SDA
RADIO_GPIOINT: J5.8 ; port LAUNCH/PB0/GPIO
RADIO_SPIINT: J5.6 ; port LAUNCH/PD7/GPIO
RADIO_UARTRX: J5.17 ; port LAUNCH/PC7/U3TX
RADIO_UARTTX: J5.15 ; port LAUNCH/PC6/U3RX
SPIBUS_B_CLK: J5.3 J6.5 ; port LAUNCH/PB4/SSI2CLK
SPIBUS_B_MISO: J5.7 J6.7 ; port LAUNCH/PB6/SSI2RX
SPIBUS_B_MOSI: J5.5 J6.3 ; port LAUNCH/PB7/SSI2TX

Not connected (* = marked no-connect by the designer): J5 10* 12* 16* 18*; J6 6* 9* 10* 11* 12* 16* 18*; J7 3* 4* 5* 6* 9* 10* 11* 12* 15* 16* 17* 18*; J8 3* 4* 5* 6* 9* 10* 11* 12* 15* 16* 17*; J15 3* 4* 5* 6* 9* 10* 11* 12* 15* 16* 17* 18*

### Notes on the sheet
- +5V0
- SPISCK
- SPICS
- GND
- SPIMOSI
- SPIMISO
- I2CSCL
- I2CSDA
- UARTTX
- SPIINT
- GPIO
- UARTRX
- ANLG
- (1) GLOBAL NETS
- (2) GLOBAL NETS
- NOTES
  -------------------------------------------------------------------------------------------------------------------------------------------------------------------------------------
  N/A
- TITLE
- SIZE
- ORGANIZATION
- PROJECT
- DESIGNER
- REVISION
- IDENTIFIER
- REVIEWER

### Library data of the parts
J5-J8 J15 = 95278-101-20LF: CONN HEADER SMD 20POS 2.54MM; Connector Type: Header, Breakaway; Pitch - Mating: 0.100" (2.54mm); Number of Positions: 20; Number of Positions Loaded: All; Style: Board to Board; Shrouding: Unshrouded; Contact Length - Mating: 0.232" (5.90mm); Material Flammability Rating: UL94 V-0; Current Rating (Amps): 3A per Contact; System: Connector; Contact Type: Male Pin; Number of Rows: 2; Row Spacing - Mating: 0.100" (2.54mm); Mounting Type: Surface Mount; Termination: Solder; Fastening Type: Push-Pull; Insulation Height: 0.100" (2.54mm); Contact Shape: Square; Contact Finish - Mating: Gold, GXT™; Contact Finish Thickness - Mating: 30.0µin (0.76µm); Contact Finish - Post: Tin; Contact Material: Phosphor Bronze; Insulation Material: Thermoplastic; Operating Temperature: -65°C ~ 125°C; Insulation Color: Black; Contact Finish Thickness - Post: 78.7µin (2.00µm); Supplier 1: Arrow Electronics; Supplier Part Number 1: 95278-101-20LF

## Sheet S05-INTERFACES.SchDoc
size B; SheetNumber: 6; SheetTotal: 7; BLOCK-TITLE: SERVO/LED MODULE INTERFACES; BLOCK-SIZE: B; BLOCK-PROJECT: MULTIMOD BASE; BLOCK-REVISION: 1; BLOCK-ORGANIZATION: UNIVERSITY OF FLORIDA; BLOCK-DESIGNER: MEHRON TALEBI; BLOCK-IDENTIFIER: SUMMER 2023; BLOCK-REVIEWER: MIKE STAPLETON
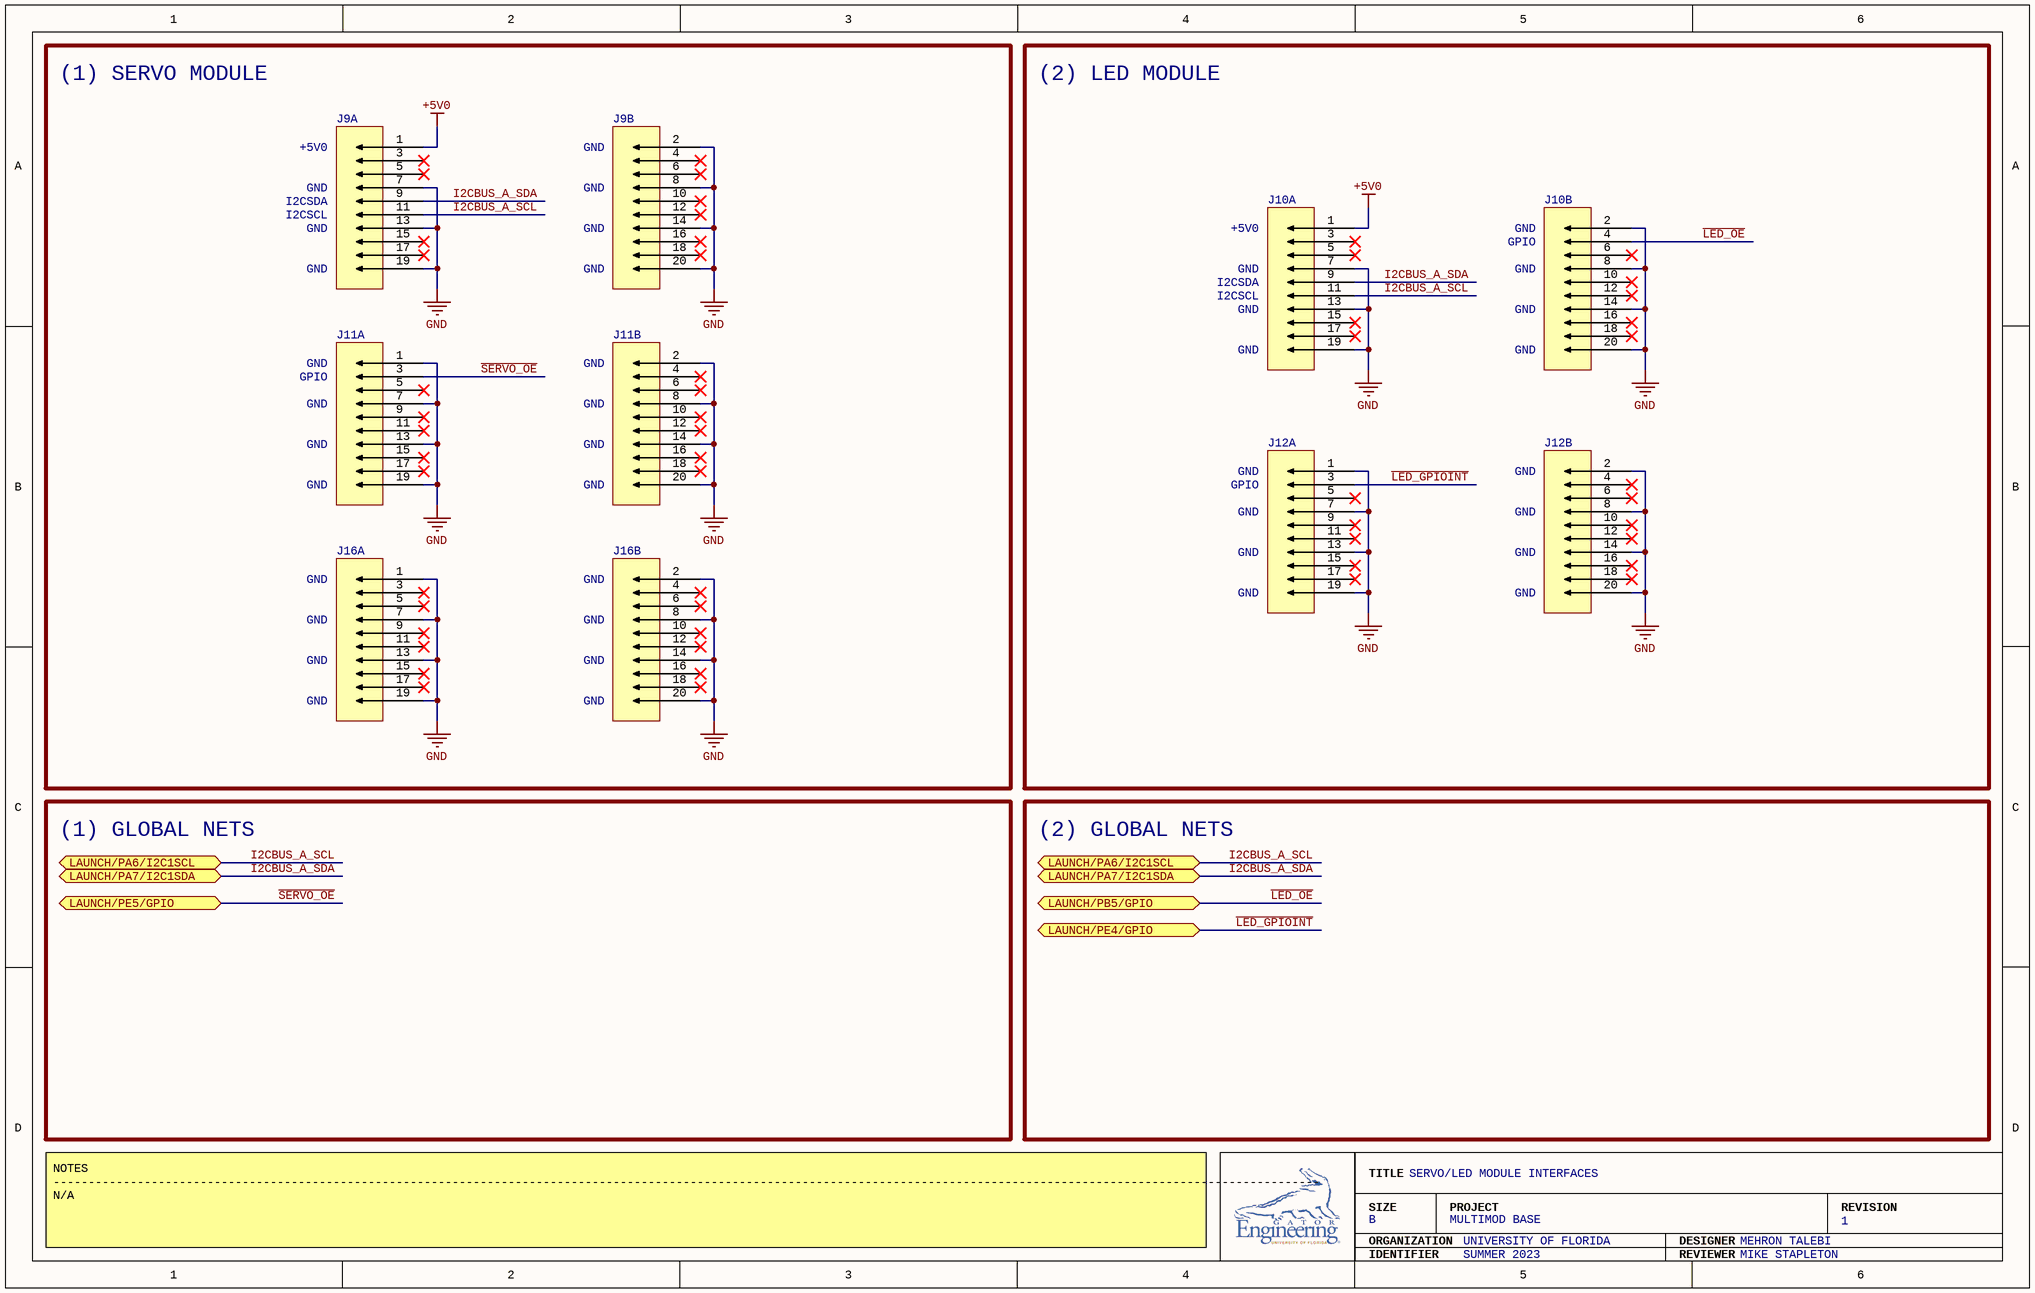
[diagram p5: S05-INTERFACES.SchDoc]

### Parts
J9  95278-101-20LF  [95278-101-20LF]  (value not drawn)  (parts A,B of 2)
J10  95278-101-20LF  [95278-101-20LF]  (value not drawn)  (parts A,B of 2)
J11  95278-101-20LF  [95278-101-20LF]  (value not drawn)  (parts A,B of 2)
J12  95278-101-20LF  [95278-101-20LF]  (value not drawn)  (parts A,B of 2)
J16  95278-101-20LF  [95278-101-20LF]  (value not drawn)  (parts A,B of 2)

### Blocks framed on the sheet
(1) SERVO MODULE: J9 J11 J16
(2) LED MODULE: J10 J12

### Ports
LAUNCH/PA6/I2C1SCL (bidir), LAUNCH/PA7/I2C1SDA (bidir), LAUNCH/PB5/GPIO (bidir), LAUNCH/PE4/GPIO (bidir), LAUNCH/PE5/GPIO (bidir)

### Nets
+5V0: J9.1 J10.1
GND: J9.2 J9.7 J9.8 J9.13 J9.14 J9.19 J9.20 J10.2 J10.7 J10.8 J10.13 J10.14 J10.19 J10.20 J11.1 J11.2 J11.7 J11.8 J11.13 J11.14 J11.19 J11.20 J12.1 J12.2 J12.7 J12.8 J12.13 J12.14 J12.19 J12.20 J16.1 J16.2 J16.7 J16.8 J16.13 J16.14 J16.19 J16.20
~{LED_GPIOINT}: J12.3 ; port LAUNCH/PE4/GPIO
~{LED_OE}: J10.4 ; port LAUNCH/PB5/GPIO
~{SERVO_OE}: J11.3 ; port LAUNCH/PE5/GPIO
I2CBUS_A_SCL: J9.11 J10.11 ; port LAUNCH/PA6/I2C1SCL
I2CBUS_A_SDA: J9.9 J10.9 ; port LAUNCH/PA7/I2C1SDA

Not connected (* = marked no-connect by the designer): J9 3* 4* 5* 6* 10* 12* 15* 16* 17* 18*; J10 3* 5* 6* 10* 12* 15* 16* 17* 18*; J11 4* 5* 6* 9* 10* 11* 12* 15* 16* 17* 18*; J12 4* 5* 6* 9* 10* 11* 12* 15* 16* 17* 18*; J16 3* 4* 5* 6* 9* 10* 11* 12* 15* 16* 17* 18*

### Notes on the sheet
- +5V0
- GND
- I2CSCL
- I2CSDA
- GPIO
- (1) GLOBAL NETS
- (2) GLOBAL NETS
- NOTES
  -------------------------------------------------------------------------------------------------------------------------------------------------------------------------------------
  N/A
- TITLE
- SIZE
- ORGANIZATION
- PROJECT
- DESIGNER
- REVISION
- IDENTIFIER
- REVIEWER

### Library data of the parts
J9-J12 J16 = 95278-101-20LF: as J5 on sheet S04-INTERFACES; Contact Type: Male Pin; Number of Rows: 2; Row Spacing - Mating: 0.100" (2.54mm); Mounting Type: Surface Mount; Termination: Solder; Fastening Type: Push-Pull; Insulation Height: 0.100" (2.54mm); Contact Shape: Square; Contact Finish - Mating: Gold, GXT™; Contact Finish Thickness - Mating: 30.0µin (0.76µm); Contact Finish - Post: Tin; Contact Material: Phosphor Bronze; Insulation Material: Thermoplastic; Operating Temperature: -65°C ~ 125°C; Insulation Color: Black; Contact Finish Thickness - Post: 78.7µin (2.00µm); Supplier 1: Arrow Electronics; Supplier Part Number 1: 95278-101-20LF

## Sheet S06-PERIPHERALS.SchDoc
size B; SheetNumber: 7; SheetTotal: 7; BLOCK-TITLE: JOYSTICK/CAMERA/TFT PERIPHERAL INTERFACES; BLOCK-SIZE: B; BLOCK-PROJECT: MULTIMOD BASE; BLOCK-REVISION: 1; BLOCK-ORGANIZATION: UNIVERSITY OF FLORIDA; BLOCK-DESIGNER: MEHRON TALEBI; BLOCK-IDENTIFIER: SUMMER 2023; BLOCK-REVIEWER: MIKE STAPLETON
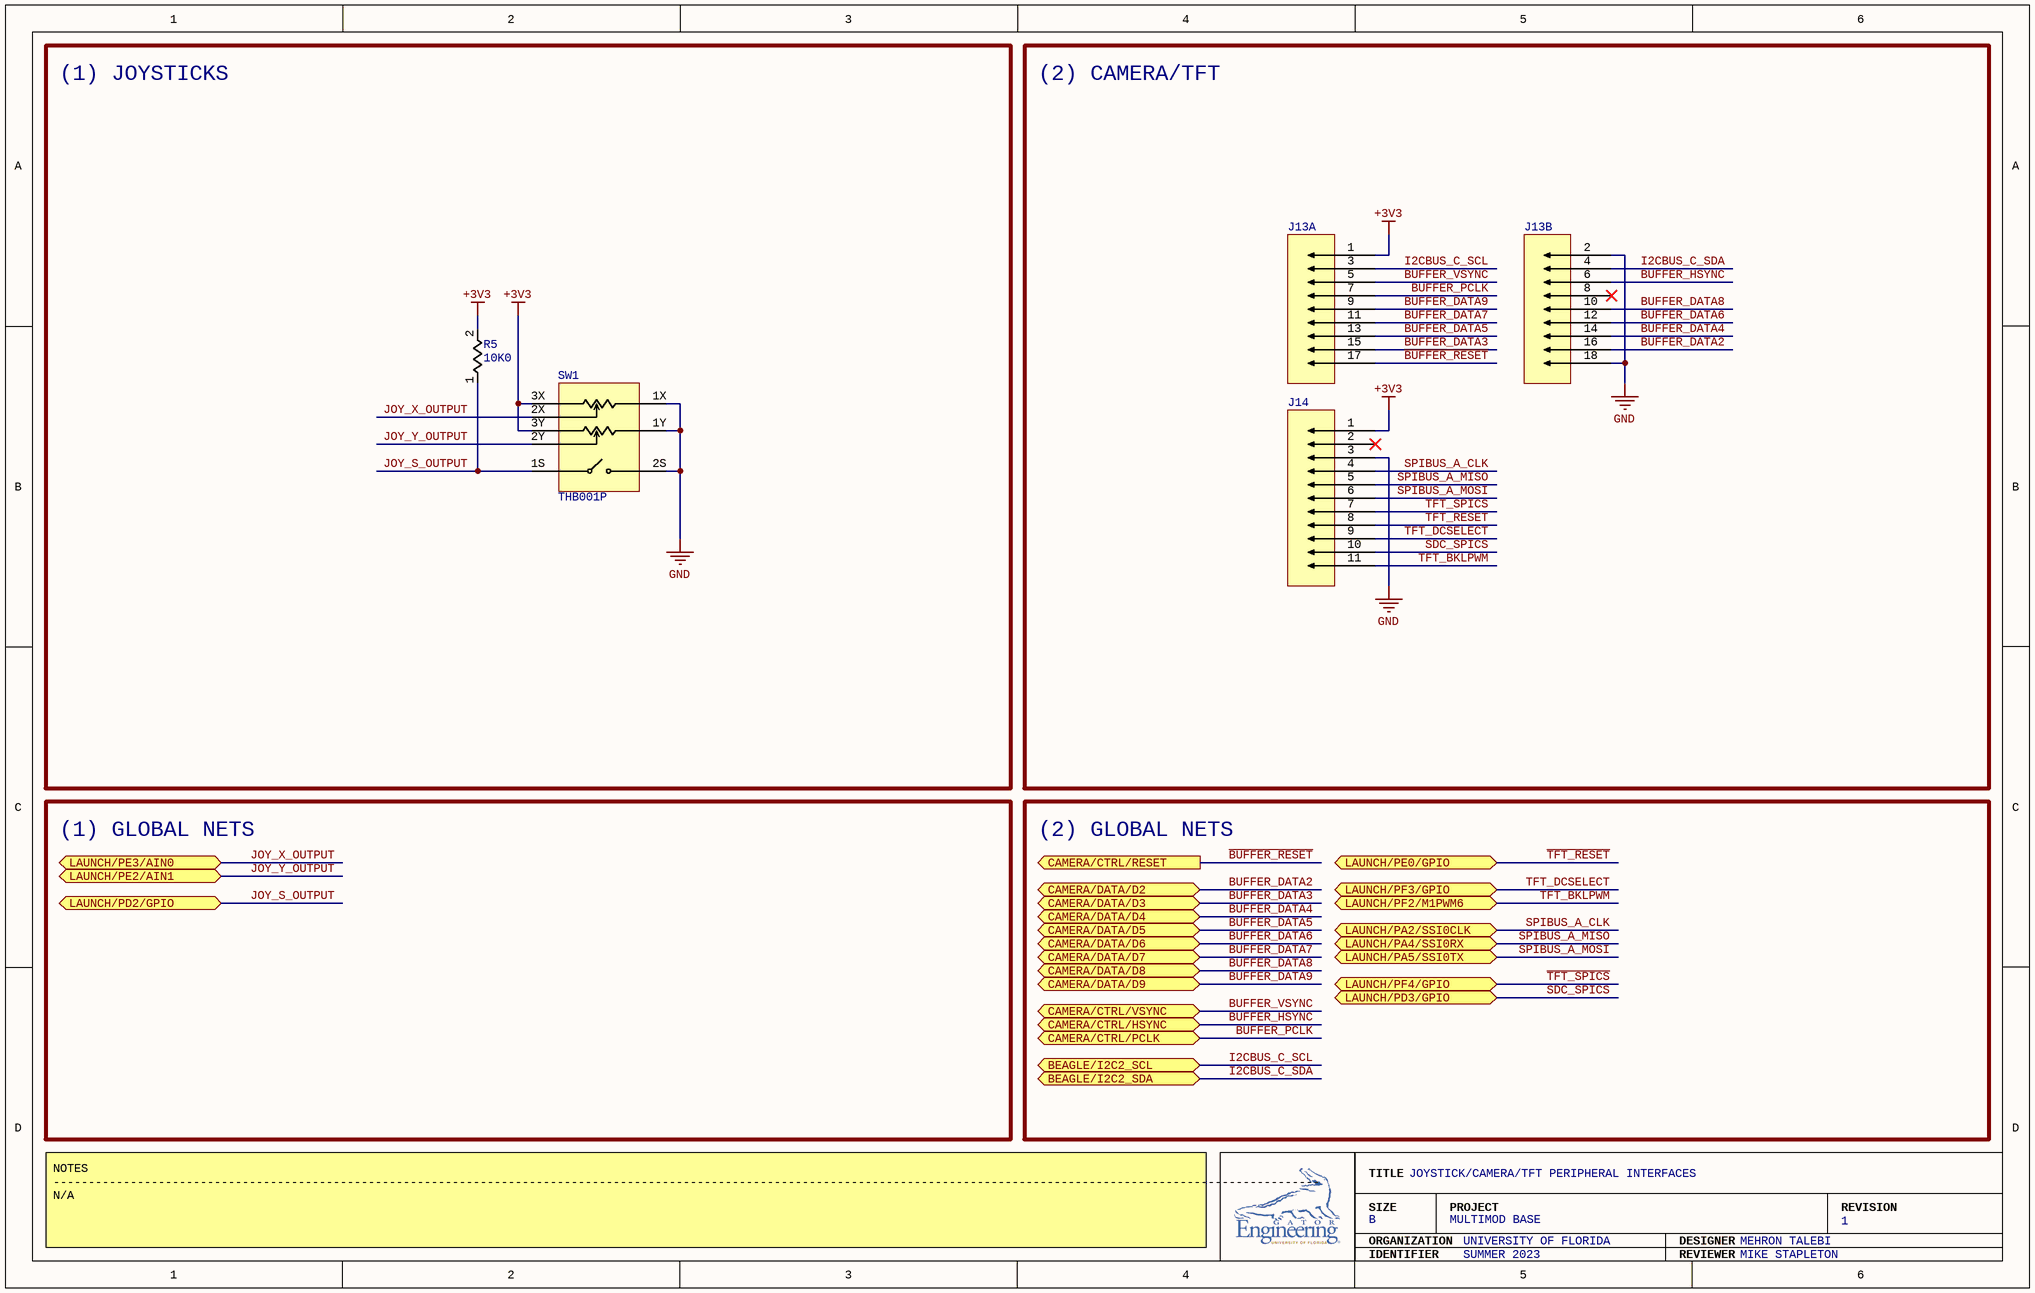
[diagram p6: S06-PERIPHERALS.SchDoc]

### Parts
J13  PPPC092LJBN-RC  [PPPC092LJBN-RC]  (value not drawn)  (parts A,B of 2)
J14  PPPC111LFBN-RC  [PPPC111LFBN-RC]  (value not drawn)
R5  10K0  [RC0805FR-0710KL]
SW1  THB001P  [THB001P]

### Blocks framed on the sheet
(1) JOYSTICKS: R5 SW1
(2) CAMERA/TFT: J13 J14

### Ports
BEAGLE/I2C2_SCL (bidir), BEAGLE/I2C2_SDA (bidir), CAMERA/CTRL/HSYNC (bidir), CAMERA/CTRL/PCLK (bidir), CAMERA/CTRL/RESET (out), CAMERA/CTRL/VSYNC (bidir), CAMERA/DATA/D2 (bidir), CAMERA/DATA/D3 (bidir), CAMERA/DATA/D4 (bidir), CAMERA/DATA/D5 (bidir), CAMERA/DATA/D6 (bidir), CAMERA/DATA/D7 (bidir), CAMERA/DATA/D8 (bidir), CAMERA/DATA/D9 (bidir), LAUNCH/PA2/SSI0CLK (bidir), LAUNCH/PA4/SSI0RX (bidir), LAUNCH/PA5/SSI0TX (bidir), LAUNCH/PD2/GPIO (bidir), LAUNCH/PD3/GPIO (bidir), LAUNCH/PE0/GPIO (bidir), LAUNCH/PE2/AIN1 (bidir), LAUNCH/PE3/AIN0 (bidir), LAUNCH/PF2/M1PWM6 (bidir), LAUNCH/PF3/GPIO (bidir), LAUNCH/PF4/GPIO (bidir)

### Nets
+3V3: J13.1 J14.1 R5.2 SW1.3X SW1.3Y
GND: J13.2 J13.18 J14.3 SW1.1X SW1.1Y SW1.2S
~{BUFFER_RESET}: J13.17 ; port CAMERA/CTRL/RESET
~{SDC_SPICS}: J14.10 ; port LAUNCH/PD3/GPIO
~{TFT_RESET}: J14.8 ; port LAUNCH/PE0/GPIO
~{TFT_SPICS}: J14.7 ; port LAUNCH/PF4/GPIO
BUFFER_DATA2: J13.16 ; port CAMERA/DATA/D2
BUFFER_DATA3: J13.15 ; port CAMERA/DATA/D3
BUFFER_DATA4: J13.14 ; port CAMERA/DATA/D4
BUFFER_DATA5: J13.13 ; port CAMERA/DATA/D5
BUFFER_DATA6: J13.12 ; port CAMERA/DATA/D6
BUFFER_DATA7: J13.11 ; port CAMERA/DATA/D7
BUFFER_DATA8: J13.10 ; port CAMERA/DATA/D8
BUFFER_DATA9: J13.9 ; port CAMERA/DATA/D9
BUFFER_HSYNC: J13.6 ; port CAMERA/CTRL/HSYNC
BUFFER_PCLK: J13.7 ; port CAMERA/CTRL/PCLK
BUFFER_VSYNC: J13.5 ; port CAMERA/CTRL/VSYNC
I2CBUS_C_SCL: J13.3 ; port BEAGLE/I2C2_SCL
I2CBUS_C_SDA: J13.4 ; port BEAGLE/I2C2_SDA
JOY_S_OUTPUT: R5.1 SW1.1S ; port LAUNCH/PD2/GPIO
JOY_X_OUTPUT: SW1.2X ; port LAUNCH/PE3/AIN0
JOY_Y_OUTPUT: SW1.2Y ; port LAUNCH/PE2/AIN1
SPIBUS_A_CLK: J14.4 ; port LAUNCH/PA2/SSI0CLK
SPIBUS_A_MISO: J14.5 ; port LAUNCH/PA4/SSI0RX
SPIBUS_A_MOSI: J14.6 ; port LAUNCH/PA5/SSI0TX
TFT_BKLPWM: J14.11 ; port LAUNCH/PF2/M1PWM6
TFT_DCSELECT: J14.9 ; port LAUNCH/PF3/GPIO

Not connected (* = marked no-connect by the designer): J13 8*; J14 2*

### Notes on the sheet
- (1) GLOBAL NETS
- (2) GLOBAL NETS
- NOTES
  -------------------------------------------------------------------------------------------------------------------------------------------------------------------------------------
  N/A
- TITLE
- SIZE
- ORGANIZATION
- PROJECT
- DESIGNER
- REVISION
- IDENTIFIER
- REVIEWER

### Library data of the parts
J13 = PPPC092LJBN-RC: CONN HDR 18POS 0.1 GOLD PCB R/A; Connector Type: Header; Style: Board to Board; Number of Positions: 18; Number of Positions Loaded: All; Pitch - Mating: 0.100" (2.54mm); Contact Length - Post: 0.124" (3.15mm); Material Flammability Rating: UL94 V-0; Current Rating (Amps): 3A; Voltage Rating: 250V; Contact Type: Female Socket; Number of Rows: 2; Row Spacing - Mating: 0.100" (2.54mm); Mounting Type: Through Hole, Right Angle; Termination: Solder; Fastening Type: Push-Pull; Contact Finish - Mating: Gold; Contact Finish Thickness - Mating: Flash; Insulation Color: Black; Insulation Height: 0.200" (5.08mm); Operating Temperature: -40°C ~ 105°C; Contact Finish - Post: Gold; Insulation Material: Polyester; Contact Shape: Square; Contact Material: Phosphor Bronze; Contact Finish Thickness - Post: Flash; Supplier 1: Digi-Key; Supplier Part Number 1: S5562-ND
J14 = PPPC111LFBN-RC: CONN HDR 11POS 0.1 GOLD PCB; Connector Type: Header; Style: Board to Board; Number of Positions: 11; Number of Positions Loaded: All; Pitch - Mating: 0.100" (2.54mm); Contact Length - Post: 0.126" (3.20mm); Material Flammability Rating: UL94 V-0; Current Rating (Amps): 3A; Contact Type: Female Socket; Number of Rows: 1; Mounting Type: Through Hole; Termination: Solder; Fastening Type: Push-Pull; Contact Finish - Mating: Gold; Contact Finish Thickness - Mating: Flash; Insulation Color: Black; Insulation Height: 0.335" (8.51mm); Operating Temperature: -40°C ~ 105°C; Contact Finish - Post: Gold; Insulation Material: Polyester; Contact Shape: Square; Contact Material: Phosphor Bronze; Contact Finish Thickness - Post: Flash; Supplier 1: Digi-Key; Supplier Part Number 1: S7044-ND
R5 = RC0805FR-0710KL: as R7 on sheet S02-BEAGLEBONE; Tolerance: ±1%; Composition: Thick Film; Features: Moisture Resistant; Operating Temperature: -55°C ~ 155°C; Package / Case: 0805 (2012 Metric); Supplier Device Package: 0805; Size / Dimension: 0.079" L x 0.049" W (2.00mm x 1.25mm); Height - Seated (Max): 0.024" (0.60mm); Number of Terminations: 2; Supplier 1: Future Electronics; Supplier Part Number 1: 3310877
SW1 = THB001P: THUMBSTICK DUAL AXIS W/MOM PB; Actuator Type: Joystick; Switch Function: 360° Directional, Center Select; Output: Analog (Resistive); Voltage Rating - AC: 50 V; Voltage Rating - DC: 5 V; Resistance: 10 kOhms; Electrical Life: 1,000,000 Cycles; Operating Force: 160gf; Type: Joystick, 2 - Axis; Mounting Type: Through Hole; Termination Style: PC Pin; Operating Temperature: -10°C ~ 70°C; Features: Center Tap; Supplier 1: Newark; Supplier Part Number 1: 66AH3097

## Nets that join several sheets
+3V3: S01-LAUNCHPAD (R1.2 R2.2 R3.2 R4.2), S02-BEAGLEBONE (R7.2), S03-BEAGLEBONE (6 pins), S06-PERIPHERALS (5 pins)
+5V0: S01-LAUNCHPAD (D2.K), S02-BEAGLEBONE (D4.K D5.K D7.K D8.K), S03-BEAGLEBONE (C1.2 VR1.3), S04-INTERFACES (J5.1 J6.1), S05-INTERFACES (J9.1 J10.1)
GND: S01-LAUNCHPAD (J1.4 J2.2), S02-BEAGLEBONE (9 pins), S03-BEAGLEBONE (10 pins), S04-INTERFACES (35 pins), S05-INTERFACES (38 pins), S06-PERIPHERALS (6 pins)
~{BEAGLE_SPICS}: S01-LAUNCHPAD (J2.18), S02-BEAGLEBONE (J4.18)
~{BUFFER_RESET}: S03-BEAGLEBONE (U2.12), S06-PERIPHERALS (J13.17)
~{CAMERA_DE}: S02-BEAGLEBONE (J3.29 R7.1), S03-BEAGLEBONE (U1.1 U1.19 U2.1)
~{CAMERA_RESET}: S02-BEAGLEBONE (J3.14), S03-BEAGLEBONE (U2.8)
~{DAC_SPICS}: S01-LAUNCHPAD (J1.20), S04-INTERFACES (J6.4)
~{LED_GPIOINT}: S01-LAUNCHPAD (J1.9), S05-INTERFACES (J12.3)
~{LED_OE}: S01-LAUNCHPAD (J1.3), S05-INTERFACES (J10.4)
~{RADIO_SPICS}: S01-LAUNCHPAD (J1.7), S04-INTERFACES (J5.4)
~{SDC_SPICS}: S01-LAUNCHPAD (J1.12), S06-PERIPHERALS (J14.10)
~{SERVO_OE}: S01-LAUNCHPAD (J1.11), S05-INTERFACES (J11.3)
~{TFT_RESET}: S01-LAUNCHPAD (J2.6), S06-PERIPHERALS (J14.8)
~{TFT_SPICS}: S01-LAUNCHPAD (J2.19), S06-PERIPHERALS (J14.7)
AUDIO_MICOUT: S01-LAUNCHPAD (J1.14), S04-INTERFACES (J8.18)
BEAGLE_SPIINT: S01-LAUNCHPAD (J2.15), S02-BEAGLEBONE (J3.10)
BEAGLE_UARTRX: S01-LAUNCHPAD (J2.9), S02-BEAGLEBONE (J4.12)
BEAGLE_UARTTX: S01-LAUNCHPAD (J2.7), S02-BEAGLEBONE (J4.14)
BUFFER_DATA2: S03-BEAGLEBONE (U1.2), S06-PERIPHERALS (J13.16)
BUFFER_DATA3: S03-BEAGLEBONE (U1.4), S06-PERIPHERALS (J13.15)
BUFFER_DATA4: S03-BEAGLEBONE (U1.6), S06-PERIPHERALS (J13.14)
BUFFER_DATA5: S03-BEAGLEBONE (U1.8), S06-PERIPHERALS (J13.13)
BUFFER_DATA6: S03-BEAGLEBONE (U1.17), S06-PERIPHERALS (J13.12)
BUFFER_DATA7: S03-BEAGLEBONE (U1.15), S06-PERIPHERALS (J13.11)
BUFFER_DATA8: S03-BEAGLEBONE (U1.13), S06-PERIPHERALS (J13.10)
BUFFER_DATA9: S03-BEAGLEBONE (U1.11), S06-PERIPHERALS (J13.9)
BUFFER_HSYNC: S03-BEAGLEBONE (U2.4), S06-PERIPHERALS (J13.6)
BUFFER_PCLK: S03-BEAGLEBONE (U2.6), S06-PERIPHERALS (J13.7)
BUFFER_VSYNC: S03-BEAGLEBONE (U2.2), S06-PERIPHERALS (J13.5)
CAMERA_DATA2: S02-BEAGLEBONE (J3.46), S03-BEAGLEBONE (U1.18)
CAMERA_DATA3: S02-BEAGLEBONE (J3.45), S03-BEAGLEBONE (U1.16)
CAMERA_DATA4: S02-BEAGLEBONE (J3.44), S03-BEAGLEBONE (U1.14)
CAMERA_DATA5: S02-BEAGLEBONE (J3.43), S03-BEAGLEBONE (U1.12)
CAMERA_DATA6: S02-BEAGLEBONE (J3.42), S03-BEAGLEBONE (U1.3)
CAMERA_DATA7: S02-BEAGLEBONE (J3.41), S03-BEAGLEBONE (U1.5)
CAMERA_DATA8: S02-BEAGLEBONE (J3.40), S03-BEAGLEBONE (U1.7)
CAMERA_DATA9: S02-BEAGLEBONE (J3.39), S03-BEAGLEBONE (U1.9)
CAMERA_HSYNC: S02-BEAGLEBONE (J3.30), S03-BEAGLEBONE (U2.16)
CAMERA_PCLK: S02-BEAGLEBONE (J3.27), S03-BEAGLEBONE (U2.14)
CAMERA_VSYNC: S02-BEAGLEBONE (J3.28), S03-BEAGLEBONE (U2.18)
I2CBUS_A_SCL: S01-LAUNCHPAD (J1.17 R2.1), S05-INTERFACES (J9.11 J10.11)
I2CBUS_A_SDA: S01-LAUNCHPAD (J1.19 R1.1), S05-INTERFACES (J9.9 J10.9)
I2CBUS_B_SCL: S01-LAUNCHPAD (J2.4 R4.1), S04-INTERFACES (J5.11 J6.17)
I2CBUS_B_SDA: S01-LAUNCHPAD (J2.5 R3.1), S04-INTERFACES (J5.9 J6.15)
I2CBUS_C_SCL: S02-BEAGLEBONE (J4.16), S06-PERIPHERALS (J13.3)
I2CBUS_C_SDA: S02-BEAGLEBONE (J4.15), S06-PERIPHERALS (J13.4)
JOY_S_OUTPUT: S01-LAUNCHPAD (J1.10), S06-PERIPHERALS (R5.1 SW1.1S)
JOY_X_OUTPUT: S01-LAUNCHPAD (J1.18), S06-PERIPHERALS (SW1.2X)
JOY_Y_OUTPUT: S01-LAUNCHPAD (J1.16), S06-PERIPHERALS (SW1.2Y)
RADIO_GPIOINT: S01-LAUNCHPAD (J1.5), S04-INTERFACES (J5.8)
RADIO_SPIINT: S01-LAUNCHPAD (J2.17), S04-INTERFACES (J5.6)
RADIO_UARTRX: S01-LAUNCHPAD (J2.13), S04-INTERFACES (J5.17)
RADIO_UARTTX: S01-LAUNCHPAD (J2.11), S04-INTERFACES (J5.15)
SPIBUS_A_CLK: S01-LAUNCHPAD (J2.20), S02-BEAGLEBONE (J4.21), S06-PERIPHERALS (J14.4)
SPIBUS_A_MISO: S01-LAUNCHPAD (J2.16), S02-BEAGLEBONE (J4.22), S06-PERIPHERALS (J14.5)
SPIBUS_A_MOSI: S01-LAUNCHPAD (J1.15), S02-BEAGLEBONE (J4.17), S06-PERIPHERALS (J14.6)
SPIBUS_B_CLK: S01-LAUNCHPAD (J1.13), S04-INTERFACES (J5.3 J6.5)
SPIBUS_B_MISO: S01-LAUNCHPAD (J2.14), S04-INTERFACES (J5.7 J6.7)
SPIBUS_B_MOSI: S01-LAUNCHPAD (J2.12), S04-INTERFACES (J5.5 J6.3)
TFT_BKLPWM: S01-LAUNCHPAD (J2.1), S06-PERIPHERALS (J14.11)
TFT_DCSELECT: S01-LAUNCHPAD (J2.3), S06-PERIPHERALS (J14.9)